# Altium project FuelCell.PrjPcb (part 2 of 3)

## Sheet TempController.SchDoc: TempController
size A3; ApprovedBy: ANBI; CheckedBy: ANBI; CompanyName: DongA FuelCell; DrawnBy: SEOKIPO; Engineer: SEOKIPO; Revision: 001; SheetNumber: 2; SheetTotal: 6
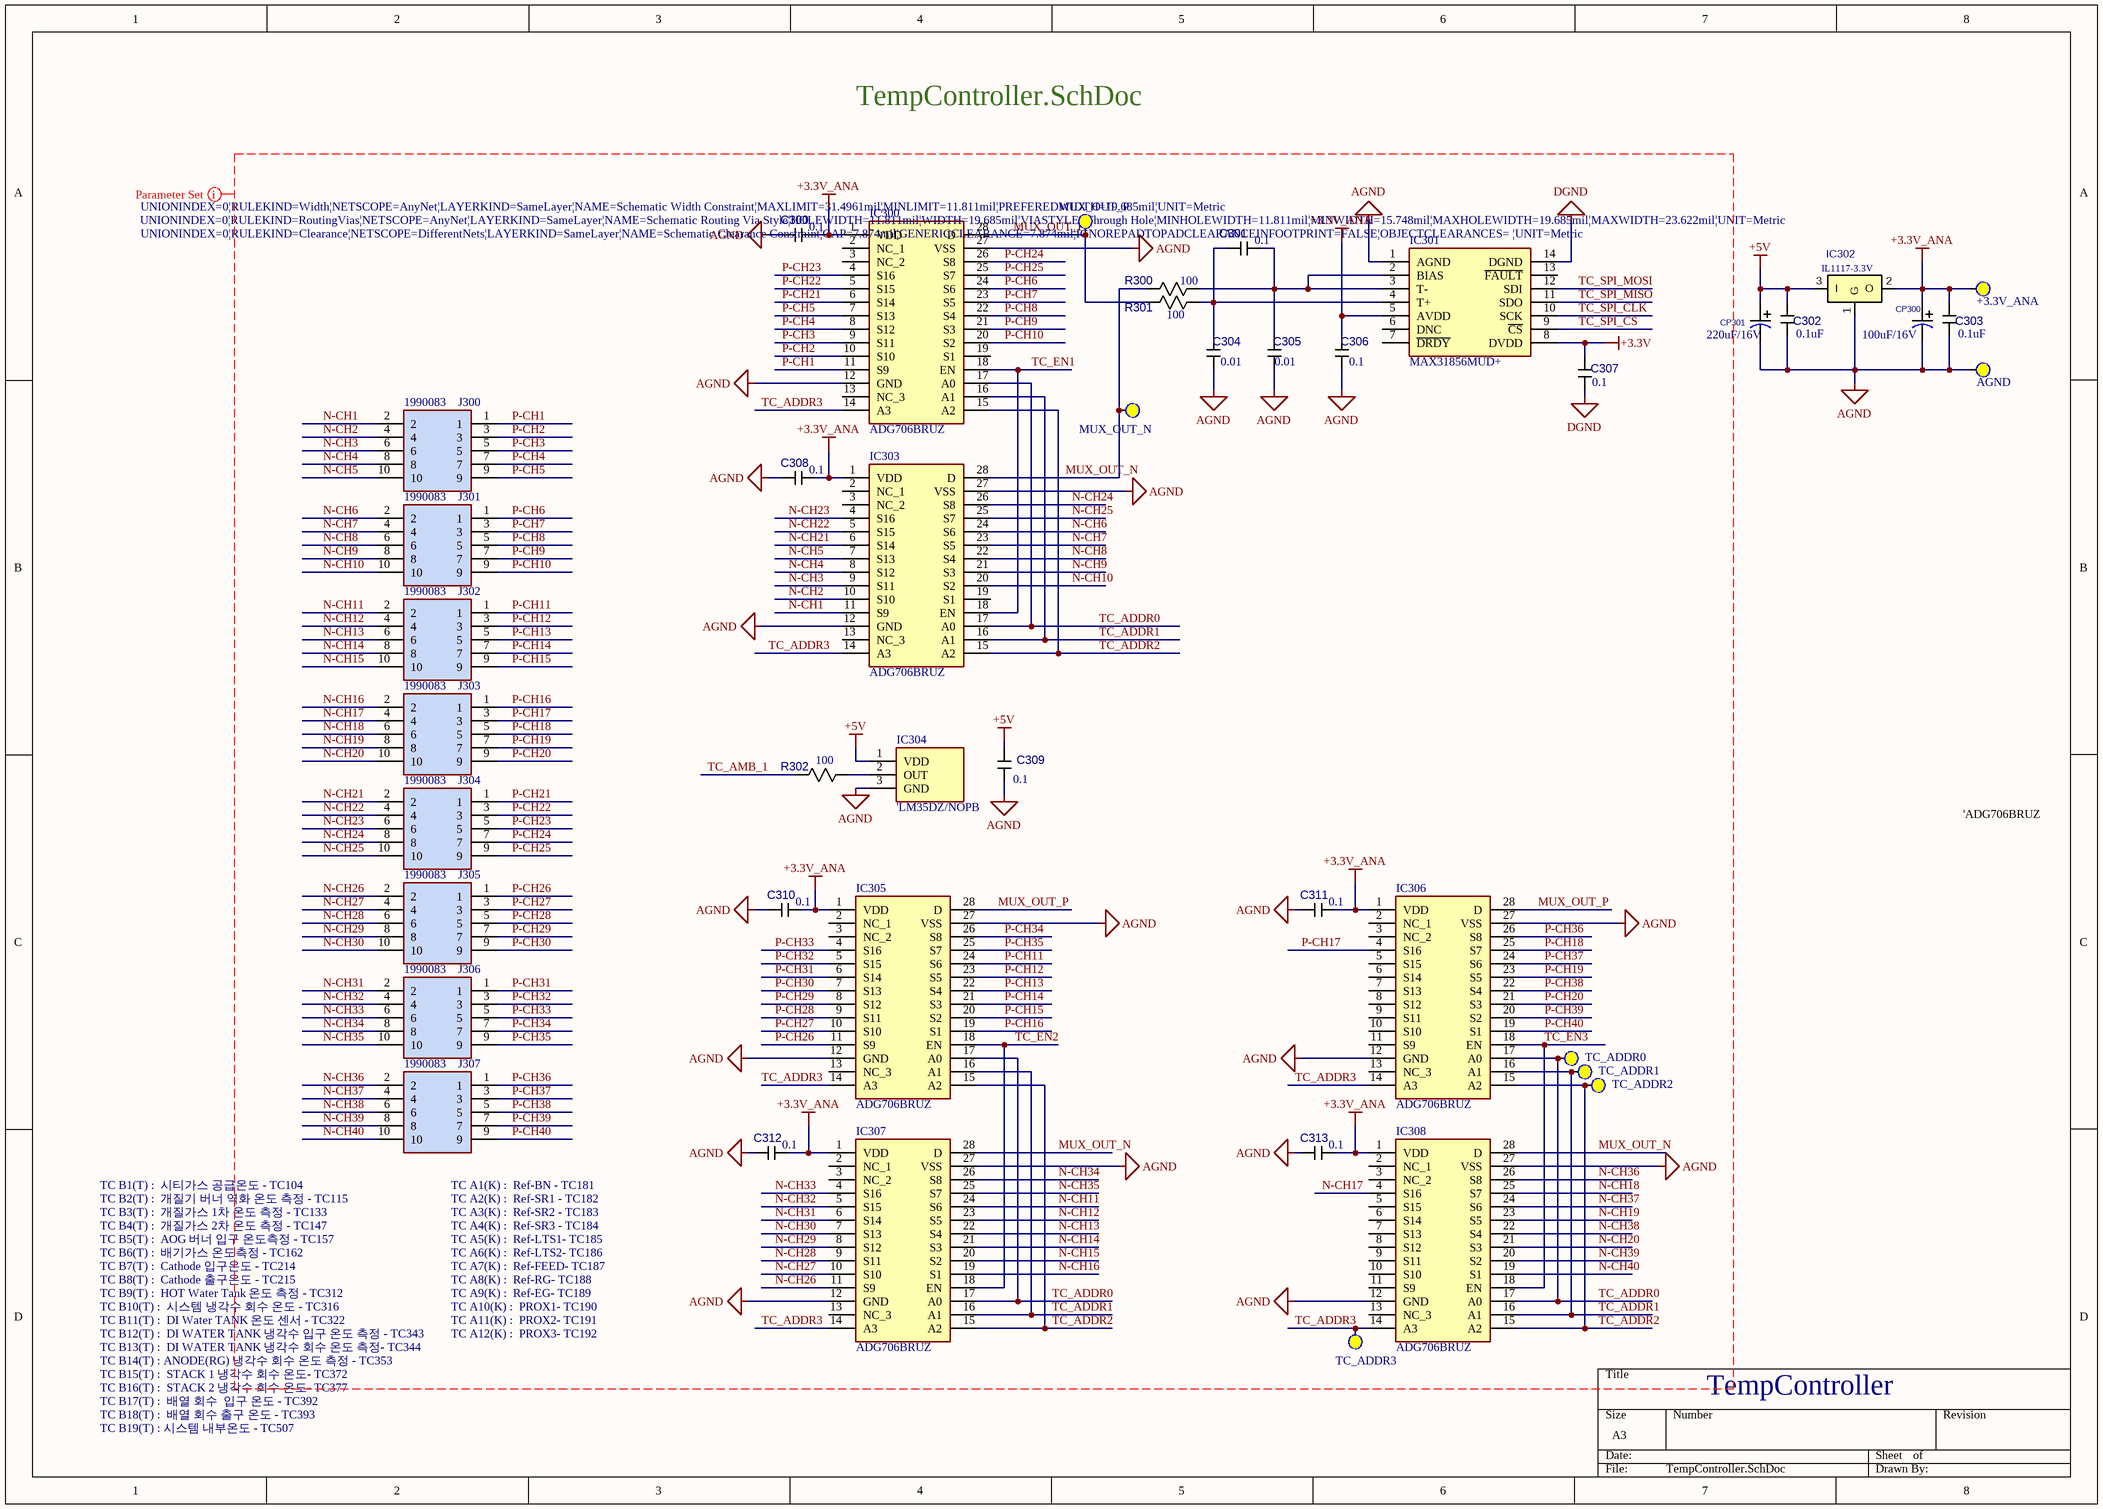
[diagram p6: TempController.SchDoc]

### Parts
(Parts that share a designator on the sheet are numbered #1, #2 ... from top to bottom, then left to right.)
+3.3V_ANA  Test Point_top  [TP_KEYSTONE_5000]  (value not drawn)
AGND#1  Test Point_top  [TP_KEYSTONE_5000]  (value not drawn)
C300  규격: 0.1  [CC1608N]  (hidden comment: CS1608)
C301  규격: 0.1  [CC1608N]  (hidden comment: CS1608)
C302  규격: 0.1uF  [CC1608N]  (hidden comment: CS1608)
C303  규격: 0.1uF  [CC1608N]  (hidden comment: CS1608)
C304  규격: 0.01  [CC1608N]  (hidden comment: CS1608)
C305  규격: 0.01  [CC1608N]  (hidden comment: CS1608)
C306  규격: 0.1  [CC1608N]  (hidden comment: CS1608)
C307  규격: 0.1  [CC1608N]  (hidden comment: CS1608)
C308  규격: 0.1  [CC1608N]  (hidden comment: CS1608)
C309  규격: 0.1  [CC1608N]  (hidden comment: CS1608)
C310  규격: 0.1  [CC1608N]  (hidden comment: CS1608)
C311  규격: 0.1  [CC1608N]  (hidden comment: CS1608)
C312  규격: 0.1  [CC1608N]  (hidden comment: CS1608)
C313  규격: 0.1  [CC1608N]  (hidden comment: CS1608)
CP300  규격: 100uF/16V  [CP5_SMT]  (hidden comment: CP5_SMT)
CP301  규격: 220uF/16V  [CP6_SMT]  (hidden comment: CP6_SMT)
IC300  ADG706BRUZ  [SOP65P640X120-28N]
IC301  MAX31856MUD+  [SOP65P640X110-14N]
IC302  Part No.: IL1117-3.3V  [SOT-223]  (hidden comment: 1117SO)
IC303  ADG706BRUZ  [SOP65P640X120-28N]
IC304  'LM35DZ/NOPB  [TO92]
IC305  ADG706BRUZ  [SOP65P640X120-28N]
IC306  ADG706BRUZ  [SOP65P640X120-28N]
IC307  ADG706BRUZ  [SOP65P640X120-28N]
IC308  ADG706BRUZ  [SOP65P640X120-28N]
J300  1990083  [1990083]
J301  1990083  [1990083]
J302  1990083  [1990083]
J303  1990083  [1990083]
J304  1990083  [1990083]
J305  1990083  [1990083]
J306  1990083  [1990083]
J307  1990083  [1990083]
MUX_OUT_N  Test Point_top  [TP_KEYSTONE_5000]  (value not drawn)
MUX_OUT_P  Test Point_top  [TP_KEYSTONE_5000]  (value not drawn)
R300  규격: 100  [RESC1608X55N]  (hidden comment: R1608)
R301  규격: 100  [RESC1608X55N]  (hidden comment: R1608)
R302  규격: 100  [RESC1608X55N]  (hidden comment: R1608)
TC_ADDR0  Test Point_top  [TP_KEYSTONE_5000]  (value not drawn)
TC_ADDR1  Test Point_top  [TP_KEYSTONE_5000]  (value not drawn)
TC_ADDR2  Test Point_top  [TP_KEYSTONE_5000]  (value not drawn)
TC_ADDR3  Test Point_top  [TP_KEYSTONE_5000]  (value not drawn)

### Nets
+3.3V: C307.2 IC301.8(DVDD)
+3.3V_ANA: +3.3V_ANA.1(tp) C300.1 C303.2 C306.2 C308.1 C310.1 C311.1 C312.1 C313.1 CP300.2 IC300.1(VDD) IC301.5(AVDD) IC302.2(O) IC303.1(VDD) IC305.1(VDD) IC306.1(VDD) IC307.1(VDD) IC308.1(VDD)
+5V: C302.2 C309.2 CP301.2 IC302.3(I) IC304.1(VDD)
AGND: AGND#1.1(tp) C300.2 C302.1 C303.1 C304.1 C305.2 C306.1 C308.2 C309.1 C310.2 C311.2 C312.2 C313.2 CP300.1 CP301.1 IC300.12(GND) IC300.27(VSS) IC301.1(AGND) IC302.1(G) IC303.12(GND) IC303.27(VSS) IC304.3(GND) IC305.12(GND) IC305.27(VSS) IC306.12(GND) IC306.27(VSS) IC307.12(GND) IC307.27(VSS) IC308.12(GND) IC308.27(VSS)
DGND: C307.1 IC301.14(DGND)
MUX_OUT_N: IC303.28(D) IC307.28(D) IC308.28(D) MUX_OUT_N.1(tp) R300.1
MUX_OUT_P: IC300.28(D) IC305.28(D) IC306.28(D) MUX_OUT_P.1(tp) R301.1
N-CH1: IC303.11(S9) J300.2
N-CH2: IC303.10(S10) J300.4
N-CH3: IC303.9(S11) J300.6
N-CH4: IC303.8(S12) J300.8
N-CH5: IC303.7(S13) J300.10
N-CH6: IC303.24(S6) J301.2
N-CH7: IC303.23(S5) J301.4
N-CH8: IC303.22(S4) J301.6
N-CH9: IC303.21(S3) J301.8
N-CH10: IC303.20(S2) J301.10
N-CH11: IC307.24(S6) J302.2
N-CH12: IC307.23(S5) J302.4
N-CH13: IC307.22(S4) J302.6
N-CH14: IC307.21(S3) J302.8
N-CH15: IC307.20(S2) J302.10
N-CH16: IC307.19(S1) J303.2
N-CH17: IC308.4(S16) J303.4
N-CH18: IC308.25(S7) J303.6
N-CH19: IC308.23(S5) J303.8
N-CH20: IC308.21(S3) J303.10
N-CH21: IC303.6(S14) J304.2
N-CH22: IC303.5(S15) J304.4
N-CH23: IC303.4(S16) J304.6
N-CH24: IC303.26(S8) J304.8
N-CH25: IC303.25(S7) J304.10
N-CH26: IC307.11(S9) J305.2
N-CH27: IC307.10(S10) J305.4
N-CH28: IC307.9(S11) J305.6
N-CH29: IC307.8(S12) J305.8
N-CH30: IC307.7(S13) J305.10
N-CH31: IC307.6(S14) J306.2
N-CH32: IC307.5(S15) J306.4
N-CH33: IC307.4(S16) J306.6
N-CH34: IC307.26(S8) J306.8
N-CH35: IC307.25(S7) J306.10
N-CH36: IC308.26(S8) J307.2
N-CH37: IC308.24(S6) J307.4
N-CH38: IC308.22(S4) J307.6
N-CH39: IC308.20(S2) J307.8
N-CH40: IC308.19(S1) J307.10
P-CH1: IC300.11(S9) J300.1
P-CH2: IC300.10(S10) J300.3
P-CH3: IC300.9(S11) J300.5
P-CH4: IC300.8(S12) J300.7
P-CH5: IC300.7(S13) J300.9
P-CH6: IC300.24(S6) J301.1
P-CH7: IC300.23(S5) J301.3
P-CH8: IC300.22(S4) J301.5
P-CH9: IC300.21(S3) J301.7
P-CH10: IC300.20(S2) J301.9
P-CH11: IC305.24(S6) J302.1
P-CH12: IC305.23(S5) J302.3
P-CH13: IC305.22(S4) J302.5
P-CH14: IC305.21(S3) J302.7
P-CH15: IC305.20(S2) J302.9
P-CH16: IC305.19(S1) J303.1
P-CH17: IC306.4(S16) J303.3
P-CH18: IC306.25(S7) J303.5
P-CH19: IC306.23(S5) J303.7
P-CH20: IC306.21(S3) J303.9
P-CH21: IC300.6(S14) J304.1
P-CH22: IC300.5(S15) J304.3
P-CH23: IC300.4(S16) J304.5
P-CH24: IC300.26(S8) J304.7
P-CH25: IC300.25(S7) J304.9
P-CH26: IC305.11(S9) J305.1
P-CH27: IC305.10(S10) J305.3
P-CH28: IC305.9(S11) J305.5
P-CH29: IC305.8(S12) J305.7
P-CH30: IC305.7(S13) J305.9
P-CH31: IC305.6(S14) J306.1
P-CH32: IC305.5(S15) J306.3
P-CH33: IC305.4(S16) J306.5
P-CH34: IC305.26(S8) J306.7
P-CH35: IC305.25(S7) J306.9
P-CH36: IC306.26(S8) J307.1
P-CH37: IC306.24(S6) J307.3
P-CH38: IC306.22(S4) J307.5
P-CH39: IC306.20(S2) J307.7
P-CH40: IC306.19(S1) J307.9
TC_ADDR0: IC300.17(A0) IC303.17(A0) IC305.17(A0) IC306.17(A0) IC307.17(A0) IC308.17(A0) TC_ADDR0.1(tp)
TC_ADDR1: IC300.16(A1) IC303.16(A1) IC305.16(A1) IC306.16(A1) IC307.16(A1) IC308.16(A1) TC_ADDR1.1(tp)
TC_ADDR2: IC300.15(A2) IC303.15(A2) IC305.15(A2) IC306.15(A2) IC307.15(A2) IC308.15(A2) TC_ADDR2.1(tp)
TC_ADDR3: IC300.14(A3) IC303.14(A3) IC305.14(A3) IC306.14(A3) IC307.14(A3) IC308.14(A3) TC_ADDR3.1(tp)
TC_AMB_1: R302.1
TC_EN1: IC300.18(EN) IC303.18(EN)
TC_EN2: IC305.18(EN) IC307.18(EN)
TC_EN3: IC306.18(EN) IC308.18(EN)
TC_SPI_CLK: IC301.10(SCK)
TC_SPI_CS: IC301.9(~{CS})
TC_SPI_MISO: IC301.11(SDO)
TC_SPI_MOSI: IC301.12(SDI)
NetC301_1: C301.1 C305.1 IC301.2(BIAS) IC301.3(T-) R300.2
NetC301_2: C301.2 C304.2 IC301.4(T+) R301.2
NetIC304_2: IC304.2(OUT) R302.2

Not connected (* = marked no-connect by the designer): IC300 2(NC_1) 3(NC_2) 13(NC_3) 19(S1); IC301 6(DNC) 7(~{DRDY}) 13(~{FAULT}); IC302 4; IC303 2(NC_1) 3(NC_2) 13(NC_3) 19(S1); IC305 2(NC_1) 3(NC_2) 13(NC_3); IC306 2(NC_1) 3(NC_2) 5(S15) 6(S14) 7(S13) 8(S12) 9(S11) 10(S10) 11(S9) 13(NC_3); IC307 2(NC_1) 3(NC_2) 13(NC_3); IC308 2(NC_1) 3(NC_2) 5(S15) 6(S14) 7(S13) 8(S12) 9(S11) 10(S10) 11(S9) 13(NC_3)

### Layout directives
rule Width Constraint [Pref Width = 0.5mm    Min Width = 0.3mm    Max Width = 0.8mm]; rule Routing Via Style [Pref Size = 0.5mm    Pref Hole Size = 0.3mm]; rule Clearance Constraint [Clearance = 0.2mm]: +3.3V, +3.3V_ANA, +5V, AGND, DGND, MUX_OUT_N, MUX_OUT_P, N-CH1, N-CH2, N-CH3, N-CH4, N-CH5, N-CH6, N-CH7, N-CH8, N-CH9, N-CH10, N-CH11, N-CH12, N-CH13, N-CH14, N-CH15, N-CH16, N-CH17, N-CH18, N-CH19, N-CH20, N-CH21, N-CH22, N-CH23, N-CH24, N-CH25, N-CH26, N-CH27, N-CH28, N-CH29, N-CH30, N-CH31, N-CH32, N-CH33, N-CH34, N-CH35, N-CH36, N-CH37, N-CH38, N-CH39, N-CH40, P-CH1, P-CH2, P-CH3, P-CH4, P-CH5, P-CH6, P-CH7, P-CH8, P-CH9, P-CH10, P-CH11, P-CH12, P-CH13, P-CH14, P-CH15, P-CH16, P-CH17, P-CH18, P-CH19, P-CH20, P-CH21, P-CH22, P-CH23, P-CH24, P-CH25, P-CH26, P-CH27, P-CH28, P-CH29, P-CH30, P-CH31, P-CH32, P-CH33, P-CH34, P-CH35, P-CH36, P-CH37, P-CH38, P-CH39, P-CH40, TC_ADDR0, TC_ADDR1, TC_ADDR2, TC_ADDR3, TC_AMB_1, TC_EN1, TC_EN2, TC_EN3, TC_SPI_CLK, TC_SPI_CS, TC_SPI_MISO, TC_SPI_MOSI

### Notes on the sheet
- TempController.SchDoc
- 'ADG706BRUZ
- TC B1(T) :  시티가스 공급온도 - TC104
- (near J307) TC A1(K) :  Ref-BN - TC181
- TC B2(T) :  개질기 버너 역화 온도 측정 - TC115
- TC B3(T) :  개질가스 1차 온도 측정 - TC133
- TC B5(T) :  AOG 버너 입구 온도측정 - TC157
- TC B4(T) :  개질가스 2차 온도 측정 - TC147
- TC B6(T) :  배기가스 온도측정 - TC162
- TC A2(K) :  Ref-SR1 - TC182
- TC A3(K) :  Ref-SR2 - TC183
- TC A4(K) :  Ref-SR3 - TC184
- TC A5(K) :  Ref-LTS1- TC185
- TC A6(K) :  Ref-LTS2- TC186
- TC B7(T) :  Cathode 입구온도 - TC214
- TC B8(T) :  Cathode 출구온도 - TC215
- TC B9(T) :  HOT Water Tank 온도 측정 - TC312
- TC B10(T) :  시스템 냉각수 회수 온도 - TC316
- TC B11(T) :  DI Water TANK 온도 센서 - TC322
- TC A8(K) :  Ref-RG- TC188
- TC A9(K) :  Ref-EG- TC189
- TC A10(K) :  PROX1- TC190
- TC A7(K) :  Ref-FEED- TC187
- TC A11(K) :  PROX2- TC191
- TC B12(T) :  DI WATER TANK 냉각수 입구 온도 측정 - TC343
- TC B13(T) :  DI WATER TANK 냉각수 회수 온도 측정- TC344
- TC B14(T) : ANODE(RG) 냉각수 회수 온도 측정 - TC353
- TC B15(T) :  STACK 1 냉각수 회수 온도- TC372
- TC B16(T) :  STACK 2 냉각수 회수 온도- TC377
- TC A12(K) :  PROX3- TC192
- TC B17(T) :  배열 회수  입구 온도 - TC392
- TC B18(T) :  배열 회수 출구 온도 - TC393
- TC B19(T) : 시스템 내부온도 - TC507

### Library data of the parts
+3.3V_ANA AGND#1 MUX_OUT_N MUX_OUT_P TC_ADDR0 TC_ADDR1 TC_ADDR3 = Tp_5000: Pad30; Part No.: *
C300-C313 = CS1608: Part No.: {Part No}; Price: 6
CP300 = CP5_SMT: Part No.: {Part No}; Price: 31
CP301 = CP6_SMT: Part No.: RV16V220 6.3X7.7 (ELNA / 삼영); ComponentLink1Description: New link; ComponentLink1URL: *; Price: 40
IC300 IC303 IC305 IC307 IC308 = ADG706BRU-REEL7: Integrated Circuit; Manufacturer_Name: Analog Devices; Height: 1.2mm; Manufacturer_Part_Number: ADG706BRU-REEL7; Price: 7220; Part No.: ADG706BRUZ
IC301 = MAX31856MUD+: Integrated Circuit; Height: 1.1mm; Part No.: MAX31856MUD+; Price: 4490
IC302 = 1117SO: Value: 3.3V/1A; Price: 150
IC304 = LM35: Integrated Circuit; Height: 4.95mm; Price: 610; Part No.: LM35DZ/NOPB
IC306 = ADG706BRU-REEL7: Integrated Circuit; Price: 7220; Part No.: ADG706BRUZ
J300-J307 = 1990083: PTSA 0,5/10-2,5-Z - Printed circuit board terminal, nominal current: 2 A, rated voltage (III/2): 250 V, nominal cross section: 0.5 mm<sup>2</sup>, number of potentials: 10, number of rows: 1, number of positions per row: 10, product range: PTSA 0,5, pitch: 2.5 mm, connection method: Push-in spring connection, mounting: Wave soldering, conductor/PCB connection direction: 45 , color: green, Pin layout: Zigzag pinning W, Solder pin [P]: 3.6 mm, number of solder pins per potential: 1, type of packaging: packed; Manufacturer_Name: Phoenix Contact; Geometry.Height: 13.1mm; Part No.: 1990083; Price: 2320
  J300: Mouser Price/Stock: https://www.mouser.co.uk/ProductDetail/Phoenix-Contact/1990083?qs=eiqBpq341KUxP7V1ZFOCBQ%3D%3D
  J301-J307: Arrow Price/Stock: https://www.arrow.com/en/products/1990083/phoenix-contact.html?utm_currency=USD&region=nac
R300-R302 = R1608: Part No.: WR06X101JT(100R)J; Price: 1.0
TC_ADDR2 = Tp_5000: Pad30; NetName: .NetName; Part No.: *

## Sheet Input_Section.SchDoc: Input_Section
size A2; Date: 2026-04-25; ApprovedBy: Anbi; CheckedBy: Anbi; Author: FunnyElecs; CompanyName: DongA; DrawnBy: Seokipo; Engineer: Seokipo; Revision: 1.0; SheetNumber: 3; SheetTotal: 6
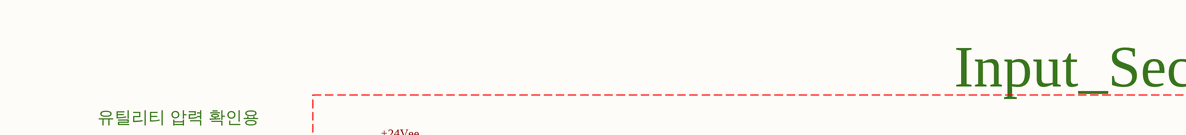
[diagram p7: Input_Section.SchDoc, top left]
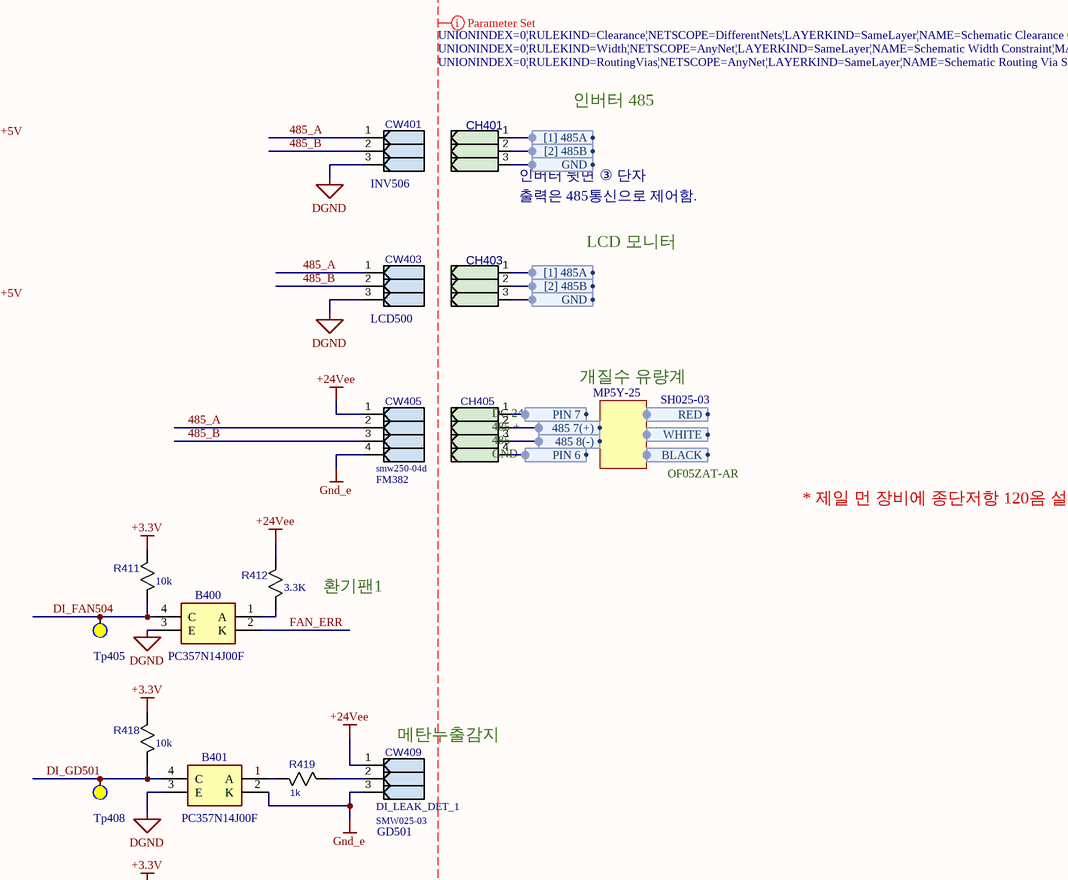
[diagram p8: Input_Section.SchDoc, top right]
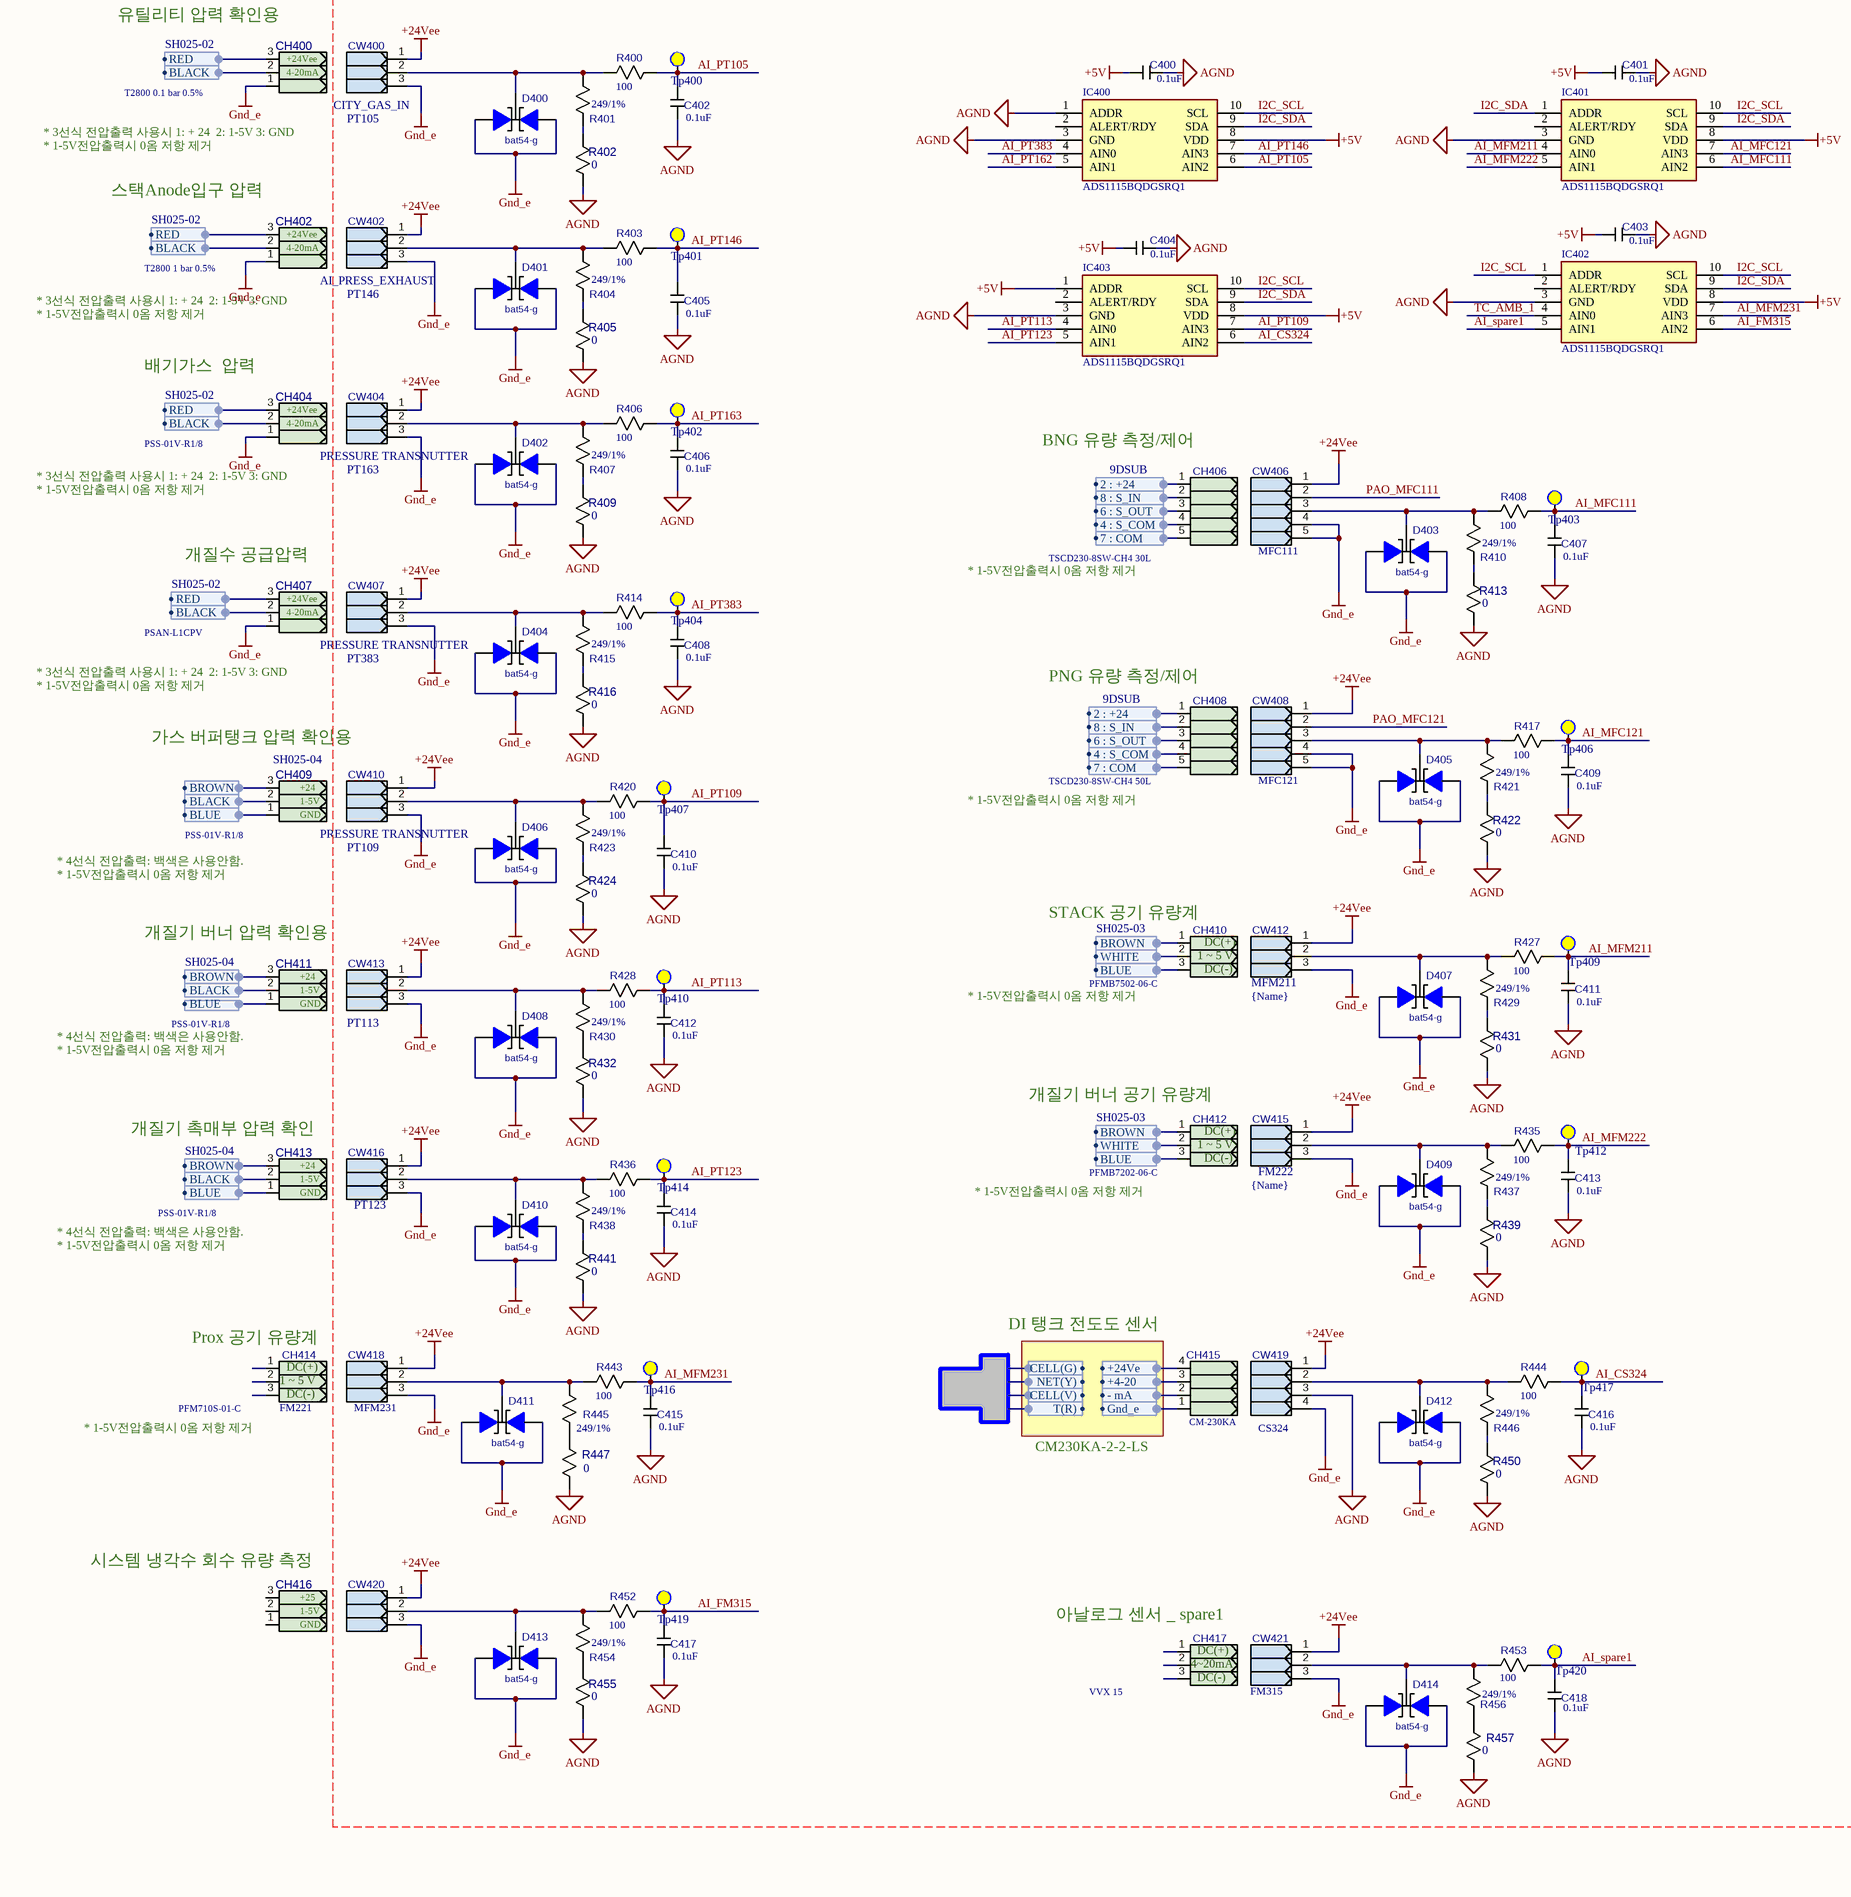
[diagram p9: Input_Section.SchDoc, bottom left]
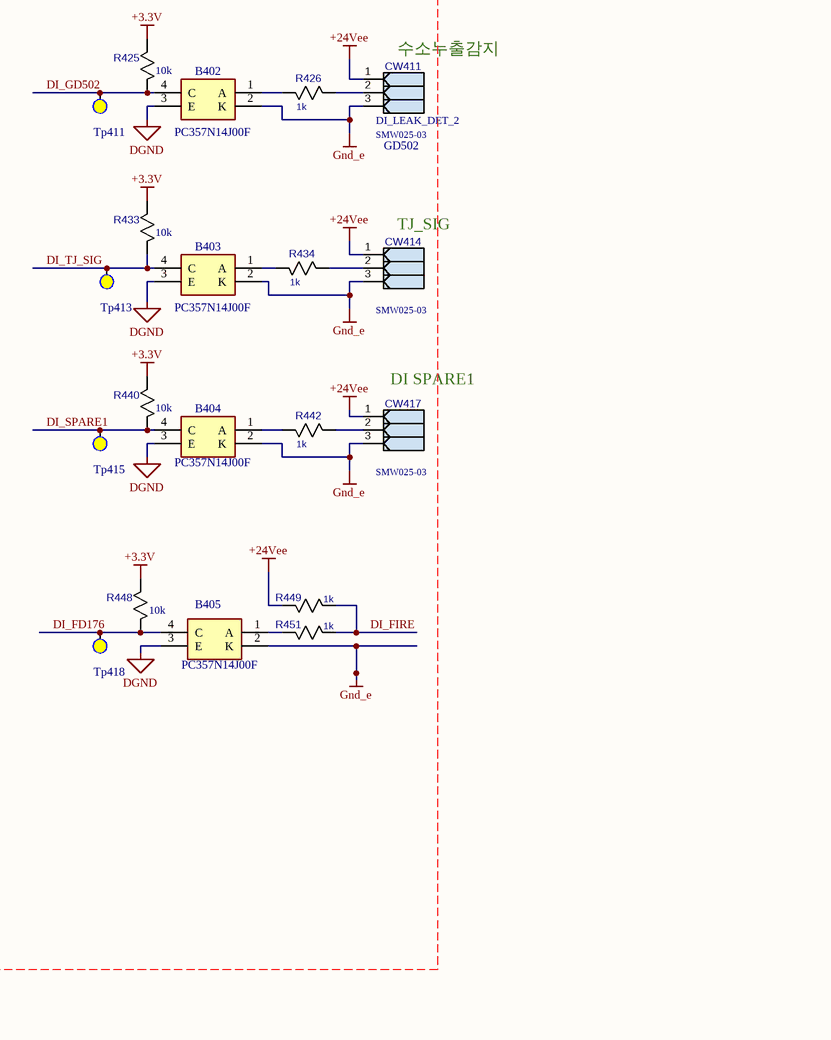
[diagram p10: Input_Section.SchDoc, bottom right]

### Parts
B400  PC357N14J00F  [SOP254P675X300-4N]
B401  PC357N14J00F  [SOP254P675X300-4N]
B402  PC357N14J00F  [SOP254P675X300-4N]
B403  PC357N14J00F  [SOP254P675X300-4N]
B404  PC357N14J00F  [SOP254P675X300-4N]
B405  PC357N14J00F  [SOP254P675X300-4N]
C400  규격: 0.1uF  [CC1608N]  (hidden comment: CS1608)
C401  규격: 0.1uF  [CC1608N]  (hidden comment: CS1608)
C402  규격: 0.1uF  [CC1608N]  (hidden comment: CS1608)
C403  규격: 0.1uF  [CC1608N]  (hidden comment: CS1608)
C404  규격: 0.1uF  [CC1608N]  (hidden comment: CS1608)
C405  규격: 0.1uF  [CC1608N]  (hidden comment: CS1608)
C406  규격: 0.1uF  [CC1608N]  (hidden comment: CS1608)
C407  규격: 0.1uF  [CC1608N]  (hidden comment: CS1608)
C408  규격: 0.1uF  [CC1608N]  (hidden comment: CS1608)
C409  규격: 0.1uF  [CC1608N]  (hidden comment: CS1608)
C410  규격: 0.1uF  [CC1608N]  (hidden comment: CS1608)
C411  규격: 0.1uF  [CC1608N]  (hidden comment: CS1608)
C412  규격: 0.1uF  [CC1608N]  (hidden comment: CS1608)
C413  규격: 0.1uF  [CC1608N]  (hidden comment: CS1608)
C414  규격: 0.1uF  [CC1608N]  (hidden comment: CS1608)
C415  규격: 0.1uF  [CC1608N]  (hidden comment: CS1608)
C416  규격: 0.1uF  [CC1608N]  (hidden comment: CS1608)
C417  규격: 0.1uF  [CC1608N]  (hidden comment: CS1608)
C418  규격: 0.1uF  [CC1608N]  (hidden comment: CS1608)
CH400  Part No.: T2800 0.1 bar 0.5%  (hidden comment: Connect Housing)
CH401  Connect Housing  (value not drawn)
CH402  Part No.: T2800 1 bar 0.5%  (hidden comment: Connect Housing)
CH403  Connect Housing  (value not drawn)
CH404  Part No.: PSS-01V-R1/8  (hidden comment: Connect Housing)
CH405  Connect Housing  (value not drawn)
CH406  Part No.: TSCD230-8SW-CH4 30L  (hidden comment: Connect Housing)
CH407  Part No.: PSAN-L1CPV  (hidden comment: Connect Housing)
CH408  Part No.: TSCD230-8SW-CH4 50L  (hidden comment: Connect Housing)
CH409  Part No.: PSS-01V-R1/8  (hidden comment: Connect Housing)
CH410  Part No.: PFMB7502-06-C  (hidden comment: Connect Housing)
CH411  Part No.: PSS-01V-R1/8  (hidden comment: Connect Housing)
CH412  Part No.: PFMB7202-06-C  (hidden comment: Connect Housing)
CH413  Part No.: PSS-01V-R1/8  (hidden comment: Connect Housing)
CH414  Part No.: PFM710S-01-C  BOP No: FM221  (hidden comment: Connect Housing)
CH415  Part No.: CM-230KA  (hidden comment: Connect Housing)
CH416  Connect Housing  (value not drawn)
CH417  Part No.: VVX 15  (hidden comment: Connect Housing)
CW400  Name: CITY_GAS_IN  BOP No: PT105  [SMW250-03D]  (hidden comment: SMW250-03D)
CW401  BOP No: INV506  [SMW250-03D]  (hidden comment: SMW250-03D)
CW402  Name: AI_PRESS_EXHAUST  BOP No: PT146  [SMW250-03D]  (hidden comment: SMW250-03D)
CW403  BOP No: LCD500  [SMW250-03D]  (hidden comment: SMW250-03D)
CW404  Name: PRESSURE TRANSNUTTER  BOP No: PT163  [SMW250-03D]  (hidden comment: SMW250-03D)
CW405  BOP No: FM382  [SMW250-04D]  (hidden comment: SMW250-04D)
CW406  BOP No: MFC111  [SMW250-05D]  (hidden comment: SMW250-05D)
CW407  Name: PRESSURE TRANSNUTTER  BOP No: PT383  [SMW250-03D]  (hidden comment: SMW250-03D)
CW408  BOP No: MFC121  [SMW250-05D]  (hidden comment: SMW250-05D)
CW409  Name: DI_LEAK_DET_1  Part No.: SMW025-03  BOP No: GD501  [SMW250-03D]  (hidden comment: SMW250-03D)
CW410  Name: PRESSURE TRANSNUTTER  BOP No: PT109  [SMW250-03D]  (hidden comment: SMW250-03D)
CW411  Name: DI_LEAK_DET_2  Part No.: SMW025-03  BOP No: GD502  [SMW250-03D]  (hidden comment: SMW250-03D)
CW412  Name: {Name}  BOP No: MFM211  [SMW250-03D]  (hidden comment: SMW250-03D)
CW413  BOP No: PT113  [SMW250-03D]  (hidden comment: SMW250-03D)
CW414  Part No.: SMW025-03  [SMW250-03D]  (hidden comment: SMW250-03D)
CW415  Name: {Name}  BOP No: FM222  [SMW250-03D]  (hidden comment: SMW250-03D)
CW416  BOP No: PT123  [SMW250-03D]  (hidden comment: SMW250-03D)
CW417  Part No.: SMW025-03  [SMW250-03D]  (hidden comment: SMW250-03D)
CW418  BOP No: MFM231  [SMW250-03D]  (hidden comment: SMW250-03D)
CW419  BOP No: CS324  [SMW250-04D]  (hidden comment: SMW250-04D)
CW420  SMW250-03D  [SMW250-03D]  (value not drawn)
CW421  BOP No: FM315  [SMW250-03D]  (hidden comment: SMW250-03D)
D400  Part No.: bat54-g  [SOT-23]  (hidden comment: BAT54C-G)
D401  Part No.: bat54-g  [SOT-23]  (hidden comment: BAT54C-G)
D402  Part No.: bat54-g  [SOT-23]  (hidden comment: BAT54C-G)
D403  Part No.: bat54-g  [SOT-23]  (hidden comment: BAT54C-G)
D404  Part No.: bat54-g  [SOT-23]  (hidden comment: BAT54C-G)
D405  Part No.: bat54-g  [SOT-23]  (hidden comment: BAT54C-G)
D406  Part No.: bat54-g  [SOT-23]  (hidden comment: BAT54C-G)
D407  Part No.: bat54-g  [SOT-23]  (hidden comment: BAT54C-G)
D408  Part No.: bat54-g  [SOT-23]  (hidden comment: BAT54C-G)
D409  Part No.: bat54-g  [SOT-23]  (hidden comment: BAT54C-G)
D410  Part No.: bat54-g  [SOT-23]  (hidden comment: BAT54C-G)
D411  Part No.: bat54-g  [SOT-23]  (hidden comment: BAT54C-G)
D412  Part No.: bat54-g  [SOT-23]  (hidden comment: BAT54C-G)
D413  Part No.: bat54-g  [SOT-23]  (hidden comment: BAT54C-G)
D414  Part No.: bat54-g  [SOT-23]  (hidden comment: BAT54C-G)
IC400  ADS1115BQDGSRQ1  [SOP50P490X110-10N]
IC401  ADS1115BQDGSRQ1  [SOP50P490X110-10N]
IC402  ADS1115BQDGSRQ1  [SOP50P490X110-10N]
IC403  ADS1115BQDGSRQ1  [SOP50P490X110-10N]
R400  규격: 100  [RESC1608X55N]  (hidden comment: R1608)
R401  규격: 249/1%  [RESC1608X55N]  (hidden comment: R1608)
R402  규격: 0  [R3216]  (hidden comment: R3216)
R403  규격: 100  [RESC1608X55N]  (hidden comment: R1608)
R404  규격: 249/1%  [RESC1608X55N]  (hidden comment: R1608)
R405  규격: 0  [R3216]  (hidden comment: R3216)
R406  규격: 100  [RESC1608X55N]  (hidden comment: R1608)
R407  규격: 249/1%  [RESC1608X55N]  (hidden comment: R1608)
R408  규격: 100  [RESC1608X55N]  (hidden comment: R1608)
R409  규격: 0  [R3216]  (hidden comment: R3216)
R410  규격: 249/1%  [RESC1608X55N]  (hidden comment: R1608)
R411  규격: 10k  [RESC1608X55N]  (hidden comment: R1608)
R412  규격: 3.3K  [RESC1608X55N]  (hidden comment: R1608)
R413  규격: 0  [R3216]  (hidden comment: R3216)
R414  규격: 100  [RESC1608X55N]  (hidden comment: R1608)
R415  규격: 249/1%  [RESC1608X55N]  (hidden comment: R1608)
R416  규격: 0  [R3216]  (hidden comment: R3216)
R417  규격: 100  [RESC1608X55N]  (hidden comment: R1608)
R418  규격: 10k  [RESC1608X55N]  (hidden comment: R1608)
R419  Part No.: 1k  [R2012]  (hidden comment: R2012)
R420  규격: 100  [RESC1608X55N]  (hidden comment: R1608)
R421  규격: 249/1%  [RESC1608X55N]  (hidden comment: R1608)
R422  규격: 0  [R3216]  (hidden comment: R3216)
R423  규격: 249/1%  [RESC1608X55N]  (hidden comment: R1608)
R424  규격: 0  [R3216]  (hidden comment: R3216)
R425  규격: 10k  [RESC1608X55N]  (hidden comment: R1608)
R426  Part No.: 1k  [R2012]  (hidden comment: R2012)
R427  규격: 100  [RESC1608X55N]  (hidden comment: R1608)
R428  규격: 100  [RESC1608X55N]  (hidden comment: R1608)
R429  규격: 249/1%  [RESC1608X55N]  (hidden comment: R1608)
R430  규격: 249/1%  [RESC1608X55N]  (hidden comment: R1608)
R431  규격: 0  [R3216]  (hidden comment: R3216)
R432  규격: 0  [R3216]  (hidden comment: R3216)
R433  규격: 10k  [RESC1608X55N]  (hidden comment: R1608)
R434  Part No.: 1k  [R2012]  (hidden comment: R2012)
R435  규격: 100  [RESC1608X55N]  (hidden comment: R1608)
R436  규격: 100  [RESC1608X55N]  (hidden comment: R1608)
R437  규격: 249/1%  [RESC1608X55N]  (hidden comment: R1608)
R438  규격: 249/1%  [RESC1608X55N]  (hidden comment: R1608)
R439  규격: 0  [R3216]  (hidden comment: R3216)
R440  규격: 10k  [RESC1608X55N]  (hidden comment: R1608)
R441  규격: 0  [R3216]  (hidden comment: R3216)
R442  Part No.: 1k  [R2012]  (hidden comment: R2012)
R443  규격: 100  [RESC1608X55N]  (hidden comment: R1608)
R444  규격: 100  [RESC1608X55N]  (hidden comment: R1608)
R445  규격: 249/1%  [RESC1608X55N]  (hidden comment: R1608)
R446  규격: 249/1%  [RESC1608X55N]  (hidden comment: R1608)
R447  규격: 0  [R3216]  (hidden comment: R3216)
R448  규격: 10k  [RESC1608X55N]  (hidden comment: R1608)
R449  Part No.: 1k  [R2012]  (hidden comment: R2012)
R450  규격: 0  [R3216]  (hidden comment: R3216)
R451  Part No.: 1k  [R2012]  (hidden comment: R2012)
R452  규격: 100  [RESC1608X55N]  (hidden comment: R1608)
R453  규격: 100  [RESC1608X55N]  (hidden comment: R1608)
R454  규격: 249/1%  [RESC1608X55N]  (hidden comment: R1608)
R455  규격: 0  [R3216]  (hidden comment: R3216)
R456  규격: 249/1%  [RESC1608X55N]  (hidden comment: R1608)
R457  규격: 0  [R3216]  (hidden comment: R3216)
Tp400  Test Point_top  [TP_KEYSTONE_5000]  (value not drawn)
Tp401  Test Point_top  [TP_KEYSTONE_5000]  (value not drawn)
Tp402  Test Point_top  [TP_KEYSTONE_5000]  (value not drawn)
Tp403  Test Point_top  [TP_KEYSTONE_5000]  (value not drawn)
Tp404  Test Point_top  [TP_KEYSTONE_5000]  (value not drawn)
Tp405  Test Point_top  [TP_KEYSTONE_5000]  (value not drawn)
Tp406  Test Point_top  [TP_KEYSTONE_5000]  (value not drawn)
Tp407  Test Point_top  [TP_KEYSTONE_5000]  (value not drawn)
Tp408  Test Point_top  [TP_KEYSTONE_5000]  (value not drawn)
Tp409  Test Point_top  [TP_KEYSTONE_5000]  (value not drawn)
Tp410  Test Point_top  [TP_KEYSTONE_5000]  (value not drawn)
Tp411  Test Point_top  [TP_KEYSTONE_5000]  (value not drawn)
Tp412  Test Point_top  [TP_KEYSTONE_5000]  (value not drawn)
Tp413  Test Point_top  [TP_KEYSTONE_5000]  (value not drawn)
Tp414  Test Point_top  [TP_KEYSTONE_5000]  (value not drawn)
Tp415  Test Point_top  [TP_KEYSTONE_5000]  (value not drawn)
Tp416  Test Point_top  [TP_KEYSTONE_5000]  (value not drawn)
Tp417  Test Point_top  [TP_KEYSTONE_5000]  (value not drawn)
Tp418  Test Point_top  [TP_KEYSTONE_5000]  (value not drawn)
Tp419  Test Point_top  [TP_KEYSTONE_5000]  (value not drawn)
Tp420  Test Point_top  [TP_KEYSTONE_5000]  (value not drawn)

### Harnesses
9DSUB: 2 : +24
*: 4 : S_COM
*: 6 : S_OUT
*: 8 : S_IN
*: 7 : COM
SH025-02: RED
?: BLACK
SH025-04: BROWN
?: BLUE
SH025-03: BROWN
?: WHITE
SH025-02: +4-20
?: - mA
SH025-03: RED
MP5Y-25: PIN 7
?: 485 7(+)
?: 485 8(-)
?: PIN 6
?: [1] 485A
?: [2] 485B
SH025-02: +24Ve
SH025-02: Gnd_e
SH025-02: NET(Y)
?: CELL(V)
SH025-02: CELL(G)
SH025-02: T(R)
?: GND

### Nets
+3.3V: R411.2 R418.2 R425.2 R433.2 R440.2 R448.2
+5V: C400.1 C401.1 C403.1 C404.1 IC400.8(VDD) IC401.8(VDD) IC402.8(VDD) IC403.1(ADDR) IC403.8(VDD)
+24Vee: CW400.1 CW402.1 CW404.1 CW405.1 CW406.1 CW407.1 CW408.1 CW409.1 CW410.1 CW411.1 CW412.1 CW413.1 CW414.1 CW415.1 CW416.1 CW417.1 CW418.1 CW419.1 CW420.1 CW421.1 R412.2 R449.2
AGND: C400.2 C401.2 C402.2 C403.2 C404.2 C405.2 C406.2 C407.2 C408.2 C409.2 C410.2 C411.2 C412.2 C413.2 C414.2 C415.2 C416.2 C417.2 C418.2 CW419.3 IC400.1(ADDR) IC400.3(GND) IC401.3(GND) IC402.3(GND) IC403.3(GND) R402.1 R405.1 R409.1 R413.1 R416.1 R422.1 R424.1 R431.1 R432.1 R439.1 R441.1 R447.1 R450.1 R455.1 R457.1
DGND: B400.3(E) B401.3(E) B402.3(E) B403.3(E) B404.3(E) B405.3(E) CW401.3 CW403.3
Gnd_e: B401.2(K) B402.2(K) B403.2(K) B404.2(K) B405.2(K) CH400.1 CH402.1 CH404.1 CH407.1 CW400.3 CW402.3 CW404.3 CW405.4 CW406.4 CW406.5 CW407.3 CW408.4 CW408.5 CW409.3 CW410.3 CW411.3 CW412.3 CW413.3 CW414.3 CW415.3 CW416.3 CW417.3 CW418.3 CW419.4 CW420.3 CW421.3 D400.1 D400.2 D401.1 D401.2 D402.1 D402.2 D403.1 D403.2 D404.1 D404.2 D405.1 D405.2 D406.1 D406.2 D407.1 D407.2 D408.1 D408.2 D409.1 D409.2 D410.1 D410.2 D411.1 D411.2 D412.1 D412.2 D413.1 D413.2 D414.1 D414.2
485_A: CW401.1 CW403.1 CW405.2
485_B: CW401.2 CW403.2 CW405.3
AI_CS324: C416.1 IC403.6(AIN2) R444.2 Tp417.1(tp)
AI_FM315: C417.1 IC402.6(AIN2) R452.2 Tp419.1(tp)
AI_MFC111: C407.1 IC401.6(AIN2) R408.2 Tp403.1(tp)
AI_MFC121: C409.1 IC401.7(AIN3) R417.2 Tp406.1(tp)
AI_MFM211: C411.1 IC401.4(AIN0) R427.2 Tp409.1(tp)
AI_MFM222: C413.1 IC401.5(AIN1) R435.2 Tp412.1(tp)
AI_MFM231: C415.1 IC402.7(AIN3) R443.2 Tp416.1(tp)
AI_PT105: C402.1 IC400.6(AIN2) R400.2 Tp400.1(tp)
AI_PT109: C410.1 IC403.7(AIN3) R420.2 Tp407.1(tp)
AI_PT113: C412.1 IC403.4(AIN0) R428.2 Tp410.1(tp)
AI_PT123: C414.1 IC403.5(AIN1) R436.2 Tp414.1(tp)
AI_PT146: C405.1 IC400.7(AIN3) R403.2 Tp401.1(tp)
AI_PT162: IC400.5(AIN1)
AI_PT163: C406.1 R406.2 Tp402.1(tp)
AI_PT383: C408.1 IC400.4(AIN0) R414.2 Tp404.1(tp)
AI_spare1: C418.1 IC402.5(AIN1) R453.2 Tp420.1(tp)
DI_FAN504: B400.4(C) R411.1 Tp405.1(tp)
DI_FD176: B405.4(C) R448.1 Tp418.1(tp)
DI_FIRE: R449.1 R451.1
DI_GD501: B401.4(C) R418.1 Tp408.1(tp)
DI_GD502: B402.4(C) R425.1 Tp411.1(tp)
DI_SPARE1: B404.4(C) R440.1 Tp415.1(tp)
DI_TJ_SIG: B403.4(C) R433.1 Tp413.1(tp)
FAN_ERR: B400.2(K)
I2C_SCL: IC400.10(SCL) IC401.10(SCL) IC402.1(ADDR) IC402.10(SCL) IC403.10(SCL)
I2C_SDA: IC400.9(SDA) IC401.1(ADDR) IC401.9(SDA) IC402.9(SDA) IC403.9(SDA)
PAO_MFC111: CW406.2
PAO_MFC121: CW408.2
TC_AMB_1: IC402.4(AIN0)
NetB400_1: B400.1(A) R412.1
NetB401_1: B401.1(A) R419.2
NetB402_1: B402.1(A) R426.2
NetB403_1: B403.1(A) R434.2
NetB404_1: B404.1(A) R442.2
NetB405_1: B405.1(A) R451.2
NetCW400_2: CW400.2 D400.3 R400.1 R401.2
NetCW402_2: CW402.2 D401.3 R403.1 R404.2
NetCW404_2: CW404.2 D402.3 R406.1 R407.2
NetCW406_3: CW406.3 D403.3 R408.1 R410.2
NetCW407_2: CW407.2 D404.3 R414.1 R415.2
NetCW408_3: CW408.3 D405.3 R417.1 R421.2
NetCW409_2: CW409.2 R419.1
NetCW410_2: CW410.2 D406.3 R420.1 R423.2
NetCW411_2: CW411.2 R426.1
NetCW412_2: CW412.2 D407.3 R427.1 R429.2
NetCW413_2: CW413.2 D408.3 R428.1 R430.2
NetCW414_2: CW414.2 R434.1
NetCW415_2: CW415.2 D409.3 R435.1 R437.2
NetCW416_2: CW416.2 D410.3 R436.1 R438.2
NetCW417_2: CW417.2 R442.1
NetCW418_2: CW418.2 D411.3 R443.1 R445.2
NetCW419_2: CW419.2 D412.3 R444.1 R446.2
NetCW420_2: CW420.2 D413.3 R452.1 R454.2
NetCW421_2: CW421.2 D414.3 R453.1 R456.2
NetR401_1: R401.1 R402.2
NetR404_1: R404.1 R405.2
NetR407_1: R407.1 R409.2
NetR410_1: R410.1 R413.2
NetR415_1: R415.1 R416.2
NetR421_1: R421.1 R422.2
NetR423_1: R423.1 R424.2
NetR429_1: R429.1 R431.2
NetR430_1: R430.1 R432.2
NetR437_1: R437.1 R439.2
NetR438_1: R438.1 R441.2
NetR445_1: R445.1 R447.2
NetR446_1: R446.1 R450.2
NetR454_1: R454.1 R455.2
NetR456_1: R456.1 R457.2

Not connected (* = marked no-connect by the designer): CH400 2 3; CH401 1 2 3; CH402 2 3; CH403 1 2 3; CH404 2 3; CH405 1 2 3 4; CH406 1 2 3 4 5; CH407 2 3; CH408 1 2 3 4 5; CH409 1 2 3; CH410 1 2 3; CH411 1 2 3; CH412 1 2 3; CH413 1 2 3; CH414 1 2 3; CH415 1 2 3 4; CH416 1 2 3; CH417 1 2 3; IC400 2(ALERT/RDY); IC401 2(ALERT/RDY); IC402 2(ALERT/RDY); IC403 2(ALERT/RDY)

### Layout directives
rule Clearance Constraint [Clearance = 0.2mm]; rule Width Constraint [Pref Width = 0.5mm    Min Width = 0.2mm    Max Width = 1mm]; rule Routing Via Style [Pref Size = 0.5mm    Pref Hole Size = 0.3mm]: 485_A, 485_B, +3.3V, +5V, +24Vee, AGND, AI_CS324, AI_FM315, AI_MFC111, AI_MFC121, AI_MFM211, AI_MFM222, AI_MFM231, AI_PT105, AI_PT109, AI_PT113, AI_PT123, AI_PT146, AI_PT162, AI_PT163, AI_PT383, AI_spare1, DGND, DI_FAN504, DI_FD176, DI_FIRE, DI_GD501, DI_GD502, DI_SPARE1, DI_TJ_SIG, FAN_ERR, Gnd_e, I2C_SCL, I2C_SDA, PAO_MFC111, PAO_MFC121, TC_AMB_1

### Notes on the sheet
- 유틸리티 압력 확인용
- Input_Section.SchDoc
- (near CH400) +24Vee
- (near CH400) 4-20mA
- (near CH400) 4-20
- (near CH400) -
- (near CH400) * 3선식 전압출력 사용시 1: + 24  2: 1-5V 3: GND
- * 1-5V전압출력시 0옴 저항 제거
- (near CH401) 인버터 485
- 스택Anode입구 압력
- (near CH402) +24Vee
- (near CH401) 인버터 뒷면 ③ 단자
- (near CH401) 출력은 485통신으로 제어함.
- (near CH402) 4-20mA
- (near CH403) LCD 모니터
- (near CH402) * 3선식 전압출력 사용시 1: + 24  2: 1-5V 3: GND
- 배기가스  압력
- (near CH404) 4-20mA
- (near CH404) +24Vee
- (near CH405) DC 24
- (near CH405) 개질수 유량계
- DC 12  5
- (near CH404) * 3선식 전압출력 사용시 1: + 24  2: 1-5V 3: GND
- BNG 유량 측정/제어
- (near CH405) 485 +
- (near CH405) 485 -
- (near CH405) GND
- cnt,1 or 2
- DC 0    4
- OF05ZAT-AR
- (near CH407) 개질수 공급압력
- * 제일 먼 장비에 종단저항 120옴 설치할것
- (near CH407) +24Vee
- (near CH407) 4-20mA
- (near R412) 환기팬1
- (near CH407) * 3선식 전압출력 사용시 1: + 24  2: 1-5V 3: GND
- (near CH408) PNG 유량 측정/제어
- (near CH409) 가스 버퍼탱크 압력 확인용
- (near CW409) 메탄누출감지
- (near CH409) 1-5V
- (near CH409) GND
- (near CH409) +24
- * 4선식 전압출력: 백색은 사용안함.
- (near CW411) 수소누출감지
- (near CH411) 개질기 버너 압력 확인용
- (near CH410) STACK 공기 유량계
- (near CH410) 1 ~ 5 V
- (near CH410) DC(+)
- (near CH410) DC(-)
- (near CH411) +24
- (near CH411) GND
- (near CH411) 1-5V
- 개질기 버너 공기 유량계
- (near CW414) TJ_SIG
- (near CH413) 개질기 촉매부 압력 확인
- (near CH413) +24
- (near CH413) 1-5V
- (near CH412) 1 ~ 5 V
- (near CH412) DC(+)
- (near CH412) DC(-)
- (near CH413) GND
- (near CW417) DI SPARE1
- (near CH414) Prox 공기 유량계
- (near CH414) DC(+)
- DI 탱크 전도도 센서
- (near CH414) 1 ~ 5 V
- (near CH414) DC(-)
- CM230KA-2-2-LS
- 시스템 냉각수 회수 유량 측정
- (near CH416) +25
- (near CH416) GND
- (near CH416) 1-5V
- (near CH417) 아날로그 센서 _ spare1
- (near CH417) 4~20mA
- (near CH417) DC(+)
- (near CH417) DC(-)

### Library data of the parts
B400-B405 = PC357N14J00F: Integrated Circuit; Part No.: PC357N14J00F; Height: 3mm; Price: 81
C400-C418 = CS1608: Part No.: {Part No}; Price: 6
CH400 CH402 = CH_03: 시티가스 공급압력 확인; Price: {Price}
CH401 CH403 = CH_03: Price: {Price}
CH404 = CH_03: 배기가스 출구 압력 측정 / O T2800 1 bar 0.5%; Price: {Price}
CH405 = CH_04: 개질수 유량계 / 사용부품 : OF05ZAT-AR; Price: {Price}
CH406 CH408 = CH_05: AI_PNG MFC / TSCD230-6SW-CH4 30L; Price: {Price}
CH407 = CH_03: 개질수 압력 / O T2800 10 bar 0.5% / O 4~20mA / O T2800 1 bar 0.5%; Price: {Price}
CH409 = CH_03: 가압 버퍼탱크 압력 측정 / 사용부품 : PSS-01A-R1/8 / O T2800 1 bar 0.5%; Price: {Price}
CH410 CH412 = CH_03: 스택 공기 유량계 / O PFMB7501-04-D / O 1 ~ 5 V 입력 / 4~20mA; Price: {Price}
CH411 CH416 = CH_03: 개질기 버너 압력 확인용 / 사용부품 : PSS-01V-R1/8 / O T2800 1 bar 0.5%; Price: {Price}
CH413 = CH_03: 개질기 촉매부 압력 확인 / 사용부품 : PSS-01V-R1/8 / O T2800 1 bar 0.5%; Price: {Price}
CH414 CH417 = CH_03: Prox 공기 유량계 / O PFMB7501-04-D / O 1 ~ 5 V 출력; Price: {Price}
CH415 = CH_04: [DI 탱크 전도도 센서] / O 4~20mA Input; Price: {Price}
CW400 = SMW250-03D: {도시가스 입압} / 사용부품 : T2800 0.1 bar 0.5% / 시티가스 공급압력 확인; Part No.: SMW025-03; Price: 31.2
CW401 CW403 CW412 CW415 = SMW250-03D: Part No.: SMW025-03; Price: 31.2
CW402 CW404 = SMW250-03D: 개질가스(스택입구) 압력 / 사용부품 : T2800 1 bar 0.5%; Part No.: SMW025-03; Price: 31.2
CW405 = SMW250-04D: 485통신; Name: {Name}; Price: 57.5; Part No.: smw250-04d
CW406 CW408 = SMW250-05D: AI_PNG MFC / TSCD230-6SW-CH4 30L; Part No.: smw025-05; Price: 67.2; Name: AI_PNG MFC
CW407 = SMW250-03D: 개질기 촉매부 압력 확인 / O 사용부품 : T2800 1 bar 0.5% / O 4~20mA Input; Part No.: SMW025-03; Price: 31.2
CW409 = SMW250-03D: GD504 / (메탄가스누출감지기): 가스가 샜을 때 경보(0 또는 1)만 던져주는 순수 상태 감시용 디지털 입력단이야. 고속 처리가 필요 없는 일반 GPIO 특성.; Price: 31.2
CW410 = SMW250-03D: 가압 버퍼탱크 압력 측정 / 사용부품 : PSS-01V-R1/8; Part No.: SMW025-03; Price: 31.2
CW411 CW417 = SMW250-03D: GD505 (수소 가스누출감지기): 가스가 샜을 때 경보(0 또는 1)만 던져주는 순수 상태 감시용 디지털 입력단이야. 고속 처리가 필요 없는 일반 GPIO 특성.; Price: 31.2
CW413 CW420 = SMW250-03D: 개질기 버너 압력 확인용 / 사용부품 : PSS-01V-R1/8; Part No.: SMW025-03; Name: AI_PT124; Price: 31.2
CW416 = SMW250-03D: 개질기 촉매부 압력 확인 / 사용부품 : PSS-01V-R1/8; Part No.: SMW025-03; Name: AI_PT124; Price: 31.2
CW418 CW421 = SMW250-03D: Part No.: SMW025-03; Name: {Name}; Price: 31.2
CW419 = SMW250-04D: [DI 탱크 전도도 센서] / O 4~20mA Input[DI 탱크 전도도 센서]; Name: AI_CS324; Price: 57.5; Part No.: smw250-04d
IC400-IC403 = ADS1115BQDGSRQ1: Integrated Circuit; Height: 1.1mm; Part No.: ADS1115BQDGSRQ1; Price: 4490
R400 R403 R406 R408 R414 R417 R420 R427 R428 R435 R436 R443 R444 R452 R453 = R1608: Part No.: WR06X101JT(100R)J; Price: 1.0
R401 R404 R407 R410 R415 R421 R423 R429 R430 R437 R438 R445 R446 R454 R456 = R1608: Part No.: WR06X2490FT(249R)F; Price: 1.0
R402 R405 R409 R413 R416 R422 R424 R431 R432 R439 R441 R447 R450 R455 R457 = R3216: Part No.: WR12X000PT(0R)J; Price: 2.1
R411 R418 R425 R433 R440 R448 = R1608: Part No.: WR06X103JT(10KR)J; Price: 1.0
R412 = R1608: Part No.: WR06X332JT(3.3KR)J; Price: 1.0
R419 R426 R434 R442 R449 R451 = R2012: 규격: {Value}; Price: 2
Tp400-Tp404 Tp406-Tp420 = Tp_5000: Pad30; Part No.: *
Tp405 = Tp_5000: Pad30; NetName: DI_FAN504; Part No.: *
CW414 = SMW250-03D: Price: 31.2
D400-D414 = BAT54C-G: Price: 35

## Sheet Mcu.SchDoc: Mcu
size A3; ApprovedBy: ANBI; CheckedBy: ANBI; CompanyName: DongA FuelCell; DrawnBy: seokipo; Engineer: seokipo; Revision: 001; SheetNumber: 4; SheetTotal: 6
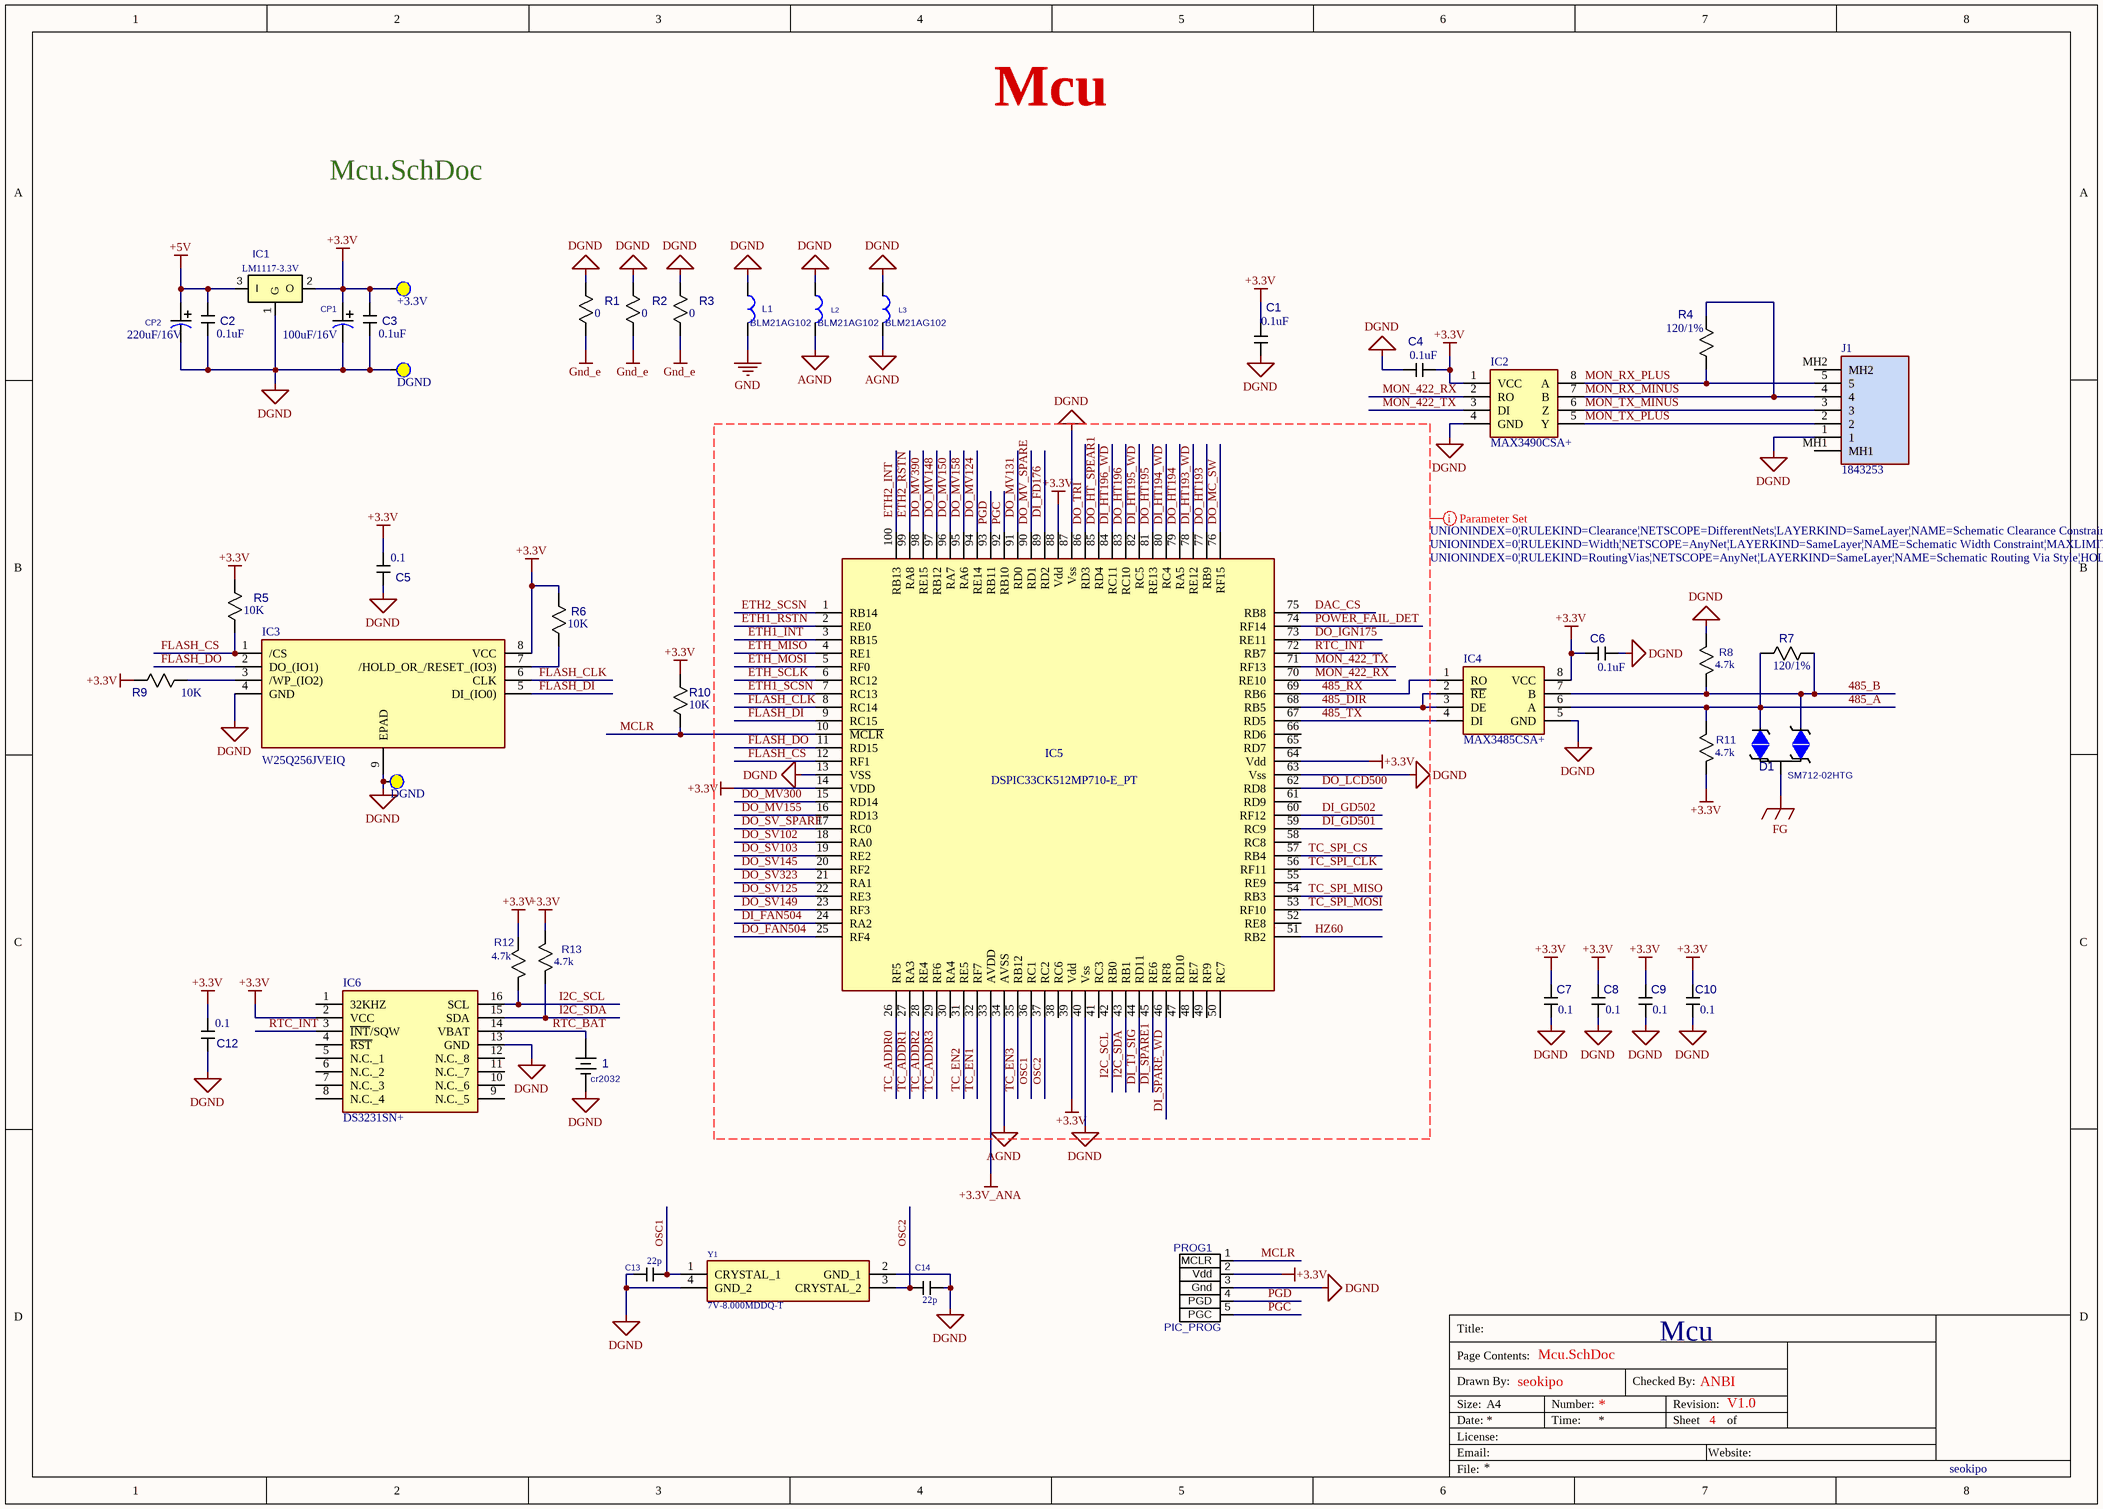
[diagram p11: Mcu.SchDoc]

### Parts
(Parts that share a designator on the sheet are numbered #1, #2 ... from top to bottom, then left to right.)
1  Part No.: cr2032  [BATT_CASE_2032]  (hidden comment: BATT_CR20)
+3.3V  Test Point_top  [TP_KEYSTONE_5000]  (value not drawn)
C1  value 0.1uF  [CC1608N]  (hidden comment: CS1608)
C2  규격: 0.1uF  [CC1608N]  (hidden comment: CS1608)
C3  규격: 0.1uF  [CC1608N]  (hidden comment: CS1608)
C4  value 0.1uF  [CC1608N]  (hidden comment: CS1608)
C5  규격: 0.1  [CC1608N]  (hidden comment: CS1608)
C6  규격: 0.1uF  [CC1608N]  (hidden comment: CS1608)
C7  규격: 0.1  [CC1608N]  (hidden comment: CS1608)
C8  규격: 0.1  [CC1608N]  (hidden comment: CS1608)
C9  규격: 0.1  [CC1608N]  (hidden comment: CS1608)
C10  규격: 0.1  [CC1608N]  (hidden comment: CS1608)
C12  규격: 0.1  [CC1608N]  (hidden comment: CS1608)
C13  규격: 22p  [CC1608N]  (hidden comment: CS1608)
C14  규격: 22p  [CC1608N]  (hidden comment: CS1608)
CP1  규격: 100uF/16V  [CP5_SMT]  (hidden comment: CP5_SMT)
CP2  규격: 220uF/16V  [CP6_SMT]  (hidden comment: CP6_SMT)
D1  Part No.: SM712-02HTG  [SOT95P240X115-3N]  (hidden comment: TVS5025)
DGND#1  Test Point_top  [TP_KEYSTONE_5000]  (value not drawn)
DGND#2  Test Point_top  [TP_KEYSTONE_5000]  (value not drawn)
IC1  Part No.: LM1117-3.3V  [SOT-223]  (hidden comment: 1117SO)
IC2  MAX3490CSA+  [SOIC127P600X175-8N]
IC3  W25Q256JVEIQ  [SON127P800X600X80-9N-D]
IC4  MAX3485CSA+  [SOIC127P600X175-8N]
IC5  DSPIC33CK512MP710-E_PT  [QFP40P1400X1400X120-100N]
IC6  DS3231SN+  [SOIC127P1032X265-16N]
J1  1843253  [1818025]
L1  Part No.: BLM21AG102  [BEADC2012X110N]  (hidden comment: L)
L2  Part No.: BLM21AG102  [BEADC2012X110N]  (hidden comment: L)
L3  Part No.: BLM21AG102  [BEADC2012X110N]  (hidden comment: L)
PROG1  PIC_PROG  [PIC_PROG]
R1  규격: 0  [R3216]  (hidden comment: R3216)
R2  규격: 0  [R3216]  (hidden comment: R3216)
R3  value 0  [R3216]  (hidden comment: R3216)
R4  value 120/1%  [R2012]  (hidden comment: R2012)
R5  규격: 10K  [RESC1608X55N]  (hidden comment: R1608)
R6  규격: 10K  [RESC1608X55N]  (hidden comment: R1608)
R7  규격: 120/1%  [R2012]  (hidden comment: R2012)
R8  규격: 4.7k  [RESC1608X55N]  (hidden comment: R1608)
R9  규격: 10K  [RESC1608X55N]  (hidden comment: R1608)
R10  규격: 10K  [RESC1608X55N]  (hidden comment: R1608)
R11  규격: 4.7k  [RESC1608X55N]  (hidden comment: R1608)
R12  value 4.7k  [RESC1608X55N]  (hidden comment: R1608)
R13  Vlaue: 4.7k  [RESC1608X55N]  (hidden comment: R1608)
Y1  7V-8.000MDDQ-T  [7M25000MEEQT]

### Nets
+3.3V: +3.3V.1(tp) C1.1 C3.2 C4.1 C5.2 C6.1 C7.2 C8.2 C9.2 C10.2 C12.2 CP1.2 IC1.2(O) IC2.1(VCC) IC3.8(VCC) IC4.8(VCC) IC5.14(VDD) IC5.39(Vdd) IC5.64(Vdd) IC5.88(Vdd) IC6.2(VCC) PROG1.2(Vdd) R5.1 R6.1 R9.1 R10.1 R11.2 R12.2 R13.2
+3.3V_ANA: IC5.33(AVDD)
+5V: C2.2 CP2.2 IC1.3(I)
AGND: IC5.34(AVSS) L2.1 L3.1
DGND: 1.2 C1.2 C2.1 C3.1 C4.2 C5.1 C6.2 C7.1 C8.1 C9.1 C10.1 C12.1 C13.2 C14.1 CP1.1 CP2.1 DGND#1.1(tp) DGND#2.1(tp) IC1.1(G) IC2.4(GND) IC3.4(GND) IC3.9(EPAD) IC4.5(GND) IC5.13(VSS) IC5.40(Vss) IC5.63(Vss) IC5.87(Vss) IC6.13(GND) J1.1 L1.2 L2.2 L3.2 PROG1.3(Gnd) R1.2 R2.2 R3.2 R8.2 Y1.2(GND_1) Y1.4(GND_2)
FG: D1.3
GND: L1.1
Gnd_e: R1.1 R2.1 R3.1
485_A: D1.2 IC4.6(A) R7.2 R11.1
485_B: D1.1 IC4.7(B) R7.1 R8.1
485_DIR: IC4.2(~{RE}) IC4.3(DE) IC5.68(RB5)
485_RX: IC4.1(RO) IC5.69(RB6)
485_TX: IC4.4(DI) IC5.67(RD5)
DAC_CS: IC5.75(RB8)
DI_FAN504: IC5.24(RA2)
DI_FD176: IC5.89(RD2)
DI_GD501: IC5.59(RC9)
DI_GD502: IC5.60(RF12)
DI_HT193_WD: IC5.78(RE12)
DI_HT194_WD: IC5.80(RC4)
DI_HT195_WD: IC5.82(RC5)
DI_HT196_WD: IC5.84(RC11)
DI_SPARE1: IC5.45(RE6)
DI_SPARE_WD: IC5.46(RF8)
DI_TJ_SIG: IC5.44(RD11)
DO_FAN504: IC5.25(RF4)
DO_HT193: IC5.77(RB9)
DO_HT194: IC5.79(RA5)
DO_HT195: IC5.81(RE13)
DO_HT196: IC5.83(RC10)
DO_HT_SPEAR1: IC5.85(RD4)
DO_IGN175: IC5.73(RE11)
DO_LCD500: IC5.62(RD8)
DO_MC_SW: IC5.76(RF15)
DO_MV124: IC5.94(RE14)
DO_MV131: IC5.91(RD0)
DO_MV148: IC5.97(RB12)
DO_MV150: IC5.96(RA7)
DO_MV155: IC5.16(RD13)
DO_MV158: IC5.95(RA6)
DO_MV300: IC5.15(RD14)
DO_MV390: IC5.98(RE15)
DO_MV_SPARE: IC5.90(RD1)
DO_SV102: IC5.18(RA0)
DO_SV103: IC5.19(RE2)
DO_SV125: IC5.22(RE3)
DO_SV145: IC5.20(RF2)
DO_SV149: IC5.23(RF3)
DO_SV323: IC5.21(RA1)
DO_SV_SPARE: IC5.17(RC0)
DO_TRI: IC5.86(RD3)
ETH1_INT: IC5.3(RB15)
ETH1_RSTN: IC5.2(RE0)
ETH1_SCSN: IC5.7(RC13)
ETH2_INT: IC5.100(RB13)
ETH2_RSTN: IC5.99(RA8)
ETH2_SCSN: IC5.1(RB14)
ETH_MISO: IC5.4(RE1)
ETH_MOSI: IC5.5(RF0)
ETH_SCLK: IC5.6(RC12)
FLASH_CLK: IC3.6(CLK) IC5.8(RC14)
FLASH_CS: IC3.1(/CS) IC5.12(RF1) R5.2
FLASH_DI: IC3.5(DI_(IO0)) IC5.9(RC15)
FLASH_DO: IC3.2(DO_(IO1)) IC5.11(RD15)
HZ60: IC5.51(RB2)
I2C_SCL: IC5.42(RB0) IC6.16(SCL) R12.1
I2C_SDA: IC5.43(RB1) IC6.15(SDA) R13.1
MCLR: IC5.10(~{MCLR}) PROG1.1(MCLR) R10.2
MON_422_RX: IC2.2(RO) IC5.70(RE10)
MON_422_TX: IC2.3(DI) IC5.71(RF13)
MON_RX_MINUS: IC2.7(B) J1.4 R4.1
MON_RX_PLUS: IC2.8(A) J1.5 R4.2
MON_TX_MINUS: IC2.6(Z) J1.3
MON_TX_PLUS: IC2.5(Y) J1.2
OSC1: C13.1 IC5.36(RC1) Y1.1(CRYSTAL_1)
OSC2: C14.2 IC5.37(RC2) Y1.3(CRYSTAL_2)
PGC: IC5.92(RB10) PROG1.5(PGC)
PGD: IC5.93(RB11) PROG1.4(PGD)
POWER_FAIL_DET: IC5.74(RF14)
RTC_BAT: 1.1 IC6.14(VBAT)
RTC_INT: IC5.72(RB7) IC6.3(~{INT}/SQW)
TC_ADDR0: IC5.26(RF5)
TC_ADDR1: IC5.27(RA3)
TC_ADDR2: IC5.28(RE4)
TC_ADDR3: IC5.29(RF6)
TC_EN1: IC5.32(RF7)
TC_EN2: IC5.31(RE5)
TC_EN3: IC5.35(RB12)
TC_SPI_CLK: IC5.56(RF11)
TC_SPI_CS: IC5.57(RB4)
TC_SPI_MISO: IC5.54(RB3)
TC_SPI_MOSI: IC5.53(RF10)
NetIC3_3: IC3.3(/WP_(IO2)) R9.2
NetIC3_7: IC3.7(/HOLD_OR_/RESET_(IO3)) R6.2

Not connected (* = marked no-connect by the designer): 1 3 4; IC1 4; IC5 30(RA4) 38(RC6) 41(RC3) 47(RD10) 48(RE7) 49(RF9) 50(RC7) 52(RE8) 55(RE9) 58(RC8) 61(RD9) 65(RD7) 66(RD6); IC6 1(32KHZ) 4(~{RST}) 5(N.C._1) 6(N.C._2) 7(N.C._3) 8(N.C._4) 9(N.C._5) 10(N.C._6) 11(N.C._7) 12(N.C._8); J1 MH1 MH2

### Layout directives
rule Clearance Constraint [Clearance = 0.15mm]; rule Width Constraint [Pref Width = 0.3mm    Min Width = 0.2mm    Max Width = 0.5mm]; rule Routing Via Style [Pref Size = 0.3mm    Pref Hole Size = 0.5mm]: 485_DIR, 485_RX, 485_TX, +3.3V, AGND, DAC_CS, DGND, DI_FAN504, DI_FD176, DI_GD501, DI_GD502, DI_HT193_WD, DI_HT194_WD, DI_HT195_WD, DI_HT196_WD, DI_SPARE1, DI_SPARE_WD, DI_TJ_SIG, DO_FAN504, DO_HT193, DO_HT194, DO_HT195, DO_HT196, DO_HT_SPEAR1, DO_IGN175, DO_LCD500, DO_MC_SW, DO_MV124, DO_MV131, DO_MV148, DO_MV150, DO_MV155, DO_MV158, DO_MV300, DO_MV390, DO_MV_SPARE, DO_SV102, DO_SV103, DO_SV125, DO_SV145, DO_SV149, DO_SV323, DO_SV_SPARE, DO_TRI, ETH1_INT, ETH1_RSTN, ETH1_SCSN, ETH2_INT, ETH2_RSTN, ETH2_SCSN, ETH_MISO, ETH_MOSI, ETH_SCLK, FLASH_CLK, FLASH_CS, FLASH_DI, FLASH_DO, HZ60, I2C_SCL, I2C_SDA, MON_422_RX, MON_422_TX, OSC1, OSC2, PGC, PGD, POWER_FAIL_DET, RTC_INT, TC_ADDR0, TC_ADDR1, TC_ADDR2, TC_ADDR3, TC_EN1, TC_EN2, TC_EN3, TC_SPI_CLK, TC_SPI_CS, TC_SPI_MISO, TC_SPI_MOSI

### Notes on the sheet
- Mcu.SchDoc
- Labels drawn without touching a wire or pin: +3.3V
- Title:
- Drawn By:
- Page Contents:
- Checked By:
- Size:
- Date:
- File:
- License:
- Email:
- A4
- Number:
- Time:
- Revision:
- Sheet
- Website:
- of

### Library data of the parts
+3.3V DGND#1 DGND#2 = Tp_5000: Pad30; Part No.: *
C1-C10 C12-C14 = CS1608: Part No.: {Part No}; Price: 6
CP1 = CP5_SMT: Part No.: {Part No}; Price: 31
CP2 = CP6_SMT: Part No.: RV16V220 6.3X7.7 (ELNA / 삼영); ComponentLink1Description: New link; ComponentLink1URL: *; Price: 40
D1 = TVS_23: Price: 370
IC1 = 1117SO: Value: {Value}; Price: {Price}
IC2 = MAX3490CSA+: Integrated Circuit; Height: 1.75mm; Part No.: MAX3490CSA+; Price: 9200
IC3 = W25Q256FVEIQ: Integrated Circuit; Height: 0.8mm; Price: 9700; Part No.: W25Q256JVEIQ
IC4 = MAX3485CSA+: Integrated Circuit; Height: 1.75mm; Part No.: MAX3485CSA+; Price: 8140
IC5 = DSPIC33CK512MP710-E_PT: Integrated Circuit; Manufacturer_Name: Microchip; Height: 1.2mm; Price: 6800; Part No.: DSPIC33CK512MP710-E_PT
IC6 = DS3231SN+: Integrated Circuit; Height: 2.65mm; Part No.: DS3231SN+; Price: 8400
J1 = 1818025: MCV 1,5/ 5-GF-3,5-LR - PCB headers, nominal cross section: 1.5 mm<sup>2</sup>, color: green, nominal current: 8 A, rated voltage (III/2): 160 V, contact surface: Sn, contact connection type: Pin, number of potentials: 5, number of rows: 1, number of positions: 5, number of connections: 5, product range: MCV 1,5/..-GF-LR, pitch: 3.5 mm, mounting: Wave soldering, pin layout: Linear pinning, solder pin [P]: 3.4 mm, number of solder pins per potential: 1, plug-in system: COMBICON MC 1,5, Pin connector pattern a; Manufacturer_Name: Phoenix Contact; Geometry.Height: 9.35mm; Part No.: 1843253; Price: 8230
L1-L3 = BEAD2012
R1-R3 = R3216: Part No.: {Part No}; Price: {Price}
R4 = R2012: Part No.: WR06X1200FT(120R)F; Price: 2
R5 R6 R9 R10 R12 R13 = R1608: Part No.: {Part No}; Price: {Price}
R7 = R2012: Part No.: {Part No}; Price: 2
R8 R11 = R1608: Part No.: WR06X472JT(4.7KR)J; Price: 1
Y1 = 7M-25.000MEEQ-T: Crystal or Oscillator; Height: 0.8mm; Price: 1100; Part No.: 7V-8.000MDDQ-T
PROG1 = PIC_PROG: Part No.: *; Price: {Price}

## Sheet Ethernet.SchDoc: Ethernet
size A4; SheetNumber: 5; SheetTotal: 6
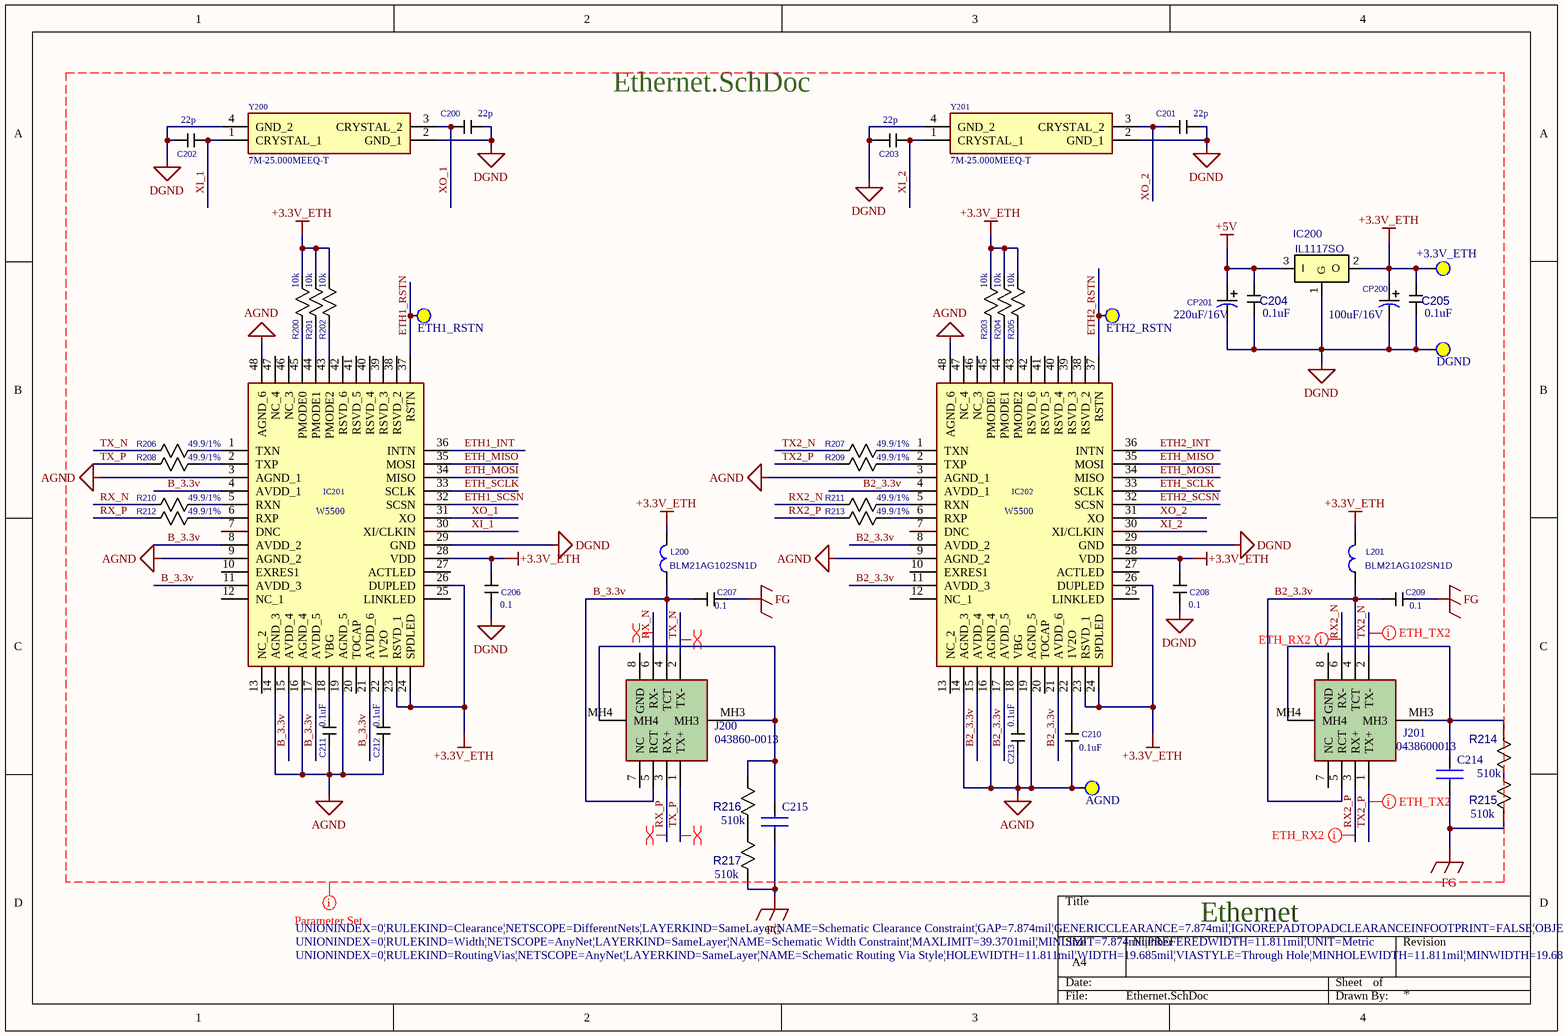
[diagram p12: Ethernet.SchDoc]

### Parts
(Parts that share a designator on the sheet are numbered #1, #2 ... from top to bottom, then left to right.)
+3.3V_ETH  Test Point_top  [TP_KEYSTONE_5000]  (value not drawn)
AGND#2  Test Point_top  [TP_KEYSTONE_5000]  (value not drawn)
C200  규격: 22p  [CC1608N]  (hidden comment: CS1608)
C201  규격: 22p  [CC1608N]  (hidden comment: CS1608)
C202  규격: 22p  [CC1608N]  (hidden comment: CS1608)
C203  규격: 22p  [CC1608N]  (hidden comment: CS1608)
C204  규격: 0.1uF  [CC1608N]  (hidden comment: CS1608)
C205  규격: 0.1uF  [CC1608N]  (hidden comment: CS1608)
C206  규격: 0.1  [CC1608N]  (hidden comment: CS1608)
C207  규격: 0.1  [CC1608N]  (hidden comment: CS1608)
C208  규격: 0.1  [CC1608N]  (hidden comment: CS1608)
C209  규격: 0.1  [CC1608N]  (hidden comment: CS1608)
C210  규격: 0.1uF  [CC1608N]  (hidden comment: CS1608)
C211  규격: 0.1uF  [CC1608N]  (hidden comment: CS1608)
C212  규격: 0.1uF  [CC1608N]  (hidden comment: CS1608)
C213  규격: 0.1uF  [CC1608N]  (hidden comment: CS1608)
C214  C4520X7R3D102K130KA  [C4520_Commercial]  (value not drawn)
C215  C4520X7R3D102K130KA  [C4520_Commercial]  (value not drawn)
CP200  규격: 100uF/16V  [CP5_SMT]  (hidden comment: CP5_SMT)
CP201  규격: 220uF/16V  [CP6_SMT]  (hidden comment: CP6_SMT)
DGND#3  Test Point_top  [TP_KEYSTONE_5000]  (value not drawn)
ETH1_RSTN  Test Point_top  [TP_KEYSTONE_5000]  (value not drawn)
ETH2_RSTN  Test Point_top  [TP_KEYSTONE_5000]  (value not drawn)
IC200  IL1117SO  [SOT-223]
IC201  W5500  [QFP50P900X900X160-48N]
IC202  W5500  [QFP50P900X900X160-48N]
J200  043860-0013  [0438600013]
J201  0438600013  [0438600013]
L200  BLM21AG102SN1D  [RESC1608X55N]
L201  BLM21AG102SN1D  [RESC1608X55N]
R200  규격: 10k  [RESC1608X55N]  (hidden comment: R1608)
R201  규격: 10k  [RESC1608X55N]  (hidden comment: R1608)
R202  규격: 10k  [RESC1608X55N]  (hidden comment: R1608)
R203  규격: 10k  [RESC1608X55N]  (hidden comment: R1608)
R204  규격: 10k  [RESC1608X55N]  (hidden comment: R1608)
R205  규격: 10k  [RESC1608X55N]  (hidden comment: R1608)
R206  규격: 49.9/1%  [RESC1608X55N]  (hidden comment: R1608)
R207  규격: 49.9/1%  [RESC1608X55N]  (hidden comment: R1608)
R208  규격: 49.9/1%  [RESC1608X55N]  (hidden comment: R1608)
R209  규격: 49.9/1%  [RESC1608X55N]  (hidden comment: R1608)
R210  규격: 49.9/1%  [RESC1608X55N]  (hidden comment: R1608)
R211  규격: 49.9/1%  [RESC1608X55N]  (hidden comment: R1608)
R212  규격: 49.9/1%  [RESC1608X55N]  (hidden comment: R1608)
R213  규격: 49.9/1%  [RESC1608X55N]  (hidden comment: R1608)
R214  규격: 510k  [R3216]  (hidden comment: R3216)
R215  규격: 510k  [R3216]  (hidden comment: R3216)
R216  규격: 510k  [R3216]  (hidden comment: R3216)
R217  규격: 510k  [R3216]  (hidden comment: R3216)
Y200  7M-25.000MEEQ-T  [7M25000MEEQT]
Y201  7M-25.000MEEQ-T  [7M25000MEEQT]

### Nets
+3.3V_ETH: +3.3V_ETH.1(tp) C205.2 C206.2 C208.2 CP200.2 IC200.2(O) IC201.23(RSVD_1) IC201.24(SPDLED) IC201.26(DUPLED) IC201.28(VDD) IC202.23(RSVD_1) IC202.24(SPDLED) IC202.26(DUPLED) IC202.28(VDD) L200.1 L201.1 R200.1 R201.1 R202.1 R203.1 R204.1 R205.1
+5V: C204.2 CP201.2 IC200.3(I)
AGND: AGND#2.1(tp) C210.2 C211.2 C212.2 C213.2 IC201.3(AGND_1) IC201.9(AGND_2) IC201.14(AGND_3) IC201.16(AGND_4) IC201.19(AGND_5) IC201.48(AGND_6) IC202.3(AGND_1) IC202.9(AGND_2) IC202.14(AGND_3) IC202.16(AGND_4) IC202.19(AGND_5) IC202.48(AGND_6)
DGND: C200.1 C201.1 C202.2 C203.2 C204.1 C205.1 C206.1 C208.1 CP200.1 CP201.1 DGND#3.1(tp) IC200.1(G) IC201.29(GND) IC202.29(GND) Y200.2(GND_1) Y200.4(GND_2) Y201.2(GND_1) Y201.4(GND_2)
FG: C207.1 C209.1 C214.2 C215.2 R215.1 R217.1
B2_3.3v: C209.2 IC202.4(AVDD_1) IC202.8(AVDD_2) IC202.11(AVDD_3) IC202.15(AVDD_4) IC202.17(AVDD_5) IC202.21(AVDD_6) J201.4(TCT) J201.5(RCT) L201.2
B_3.3v: C207.2 IC201.4(AVDD_1) IC201.8(AVDD_2) IC201.11(AVDD_3) IC201.15(AVDD_4) IC201.17(AVDD_5) IC201.21(AVDD_6) J200.4(TCT) J200.5(RCT) L200.2
ETH1_INT: IC201.36(INTN)
ETH1_RSTN: ETH1_RSTN.1(tp) IC201.37(RSTN)
ETH1_SCSN: IC201.32(SCSN)
ETH2_INT: IC202.36(INTN)
ETH2_RSTN: ETH2_RSTN.1(tp) IC202.37(RSTN)
ETH2_SCSN: IC202.32(SCSN)
ETH_MISO: IC201.35(MOSI) IC202.35(MOSI)
ETH_MOSI: IC201.34(MISO) IC202.34(MISO)
ETH_SCLK: IC201.33(SCLK) IC202.33(SCLK)
RX2_N: J201.6(RX-) R211.1
RX2_P: J201.3(RX+) R213.1
RX_N: J200.6(RX-) R210.1
RX_P: J200.3(RX+) R212.1
TX2_N: J201.2(TX-) R207.1
TX2_P: J201.1(TX+) R209.1
TX_N: J200.2(TX-) R206.1
TX_P: J200.1(TX+) R208.1
XI_1: C202.1 IC201.30(XI/CLKIN) Y200.1(CRYSTAL_1)
XI_2: C203.1 IC202.30(XI/CLKIN) Y201.1(CRYSTAL_1)
XO_1: C200.2 IC201.31(XO) Y200.3(CRYSTAL_2)
XO_2: C201.2 IC202.31(XO) Y201.3(CRYSTAL_2)
NetC210_1: C210.1 IC202.22(1V2O)
NetC211_1: C211.1 IC201.18(VBG)
NetC212_1: C212.1 IC201.22(1V2O)
NetC213_1: C213.1 IC202.18(VBG)
NetC214_1: C214.1 J201.MH3 J201.MH4 R214.2
NetC215_1: C215.1 J200.MH3 J200.MH4 R216.2
NetIC201_1: IC201.1(TXN) R206.2
NetIC201_2: IC201.2(TXP) R208.2
NetIC201_5: IC201.5(RXN) R210.2
NetIC201_6: IC201.6(RXP) R212.2
NetIC201_43: IC201.43(PMODE2) R202.2
NetIC201_44: IC201.44(PMODE1) R201.2
NetIC201_45: IC201.45(PMODE0) R200.2
NetIC202_1: IC202.1(TXN) R207.2
NetIC202_2: IC202.2(TXP) R209.2
NetIC202_5: IC202.5(RXN) R211.2
NetIC202_6: IC202.6(RXP) R213.2
NetIC202_43: IC202.43(PMODE2) R205.2
NetIC202_44: IC202.44(PMODE1) R204.2
NetIC202_45: IC202.45(PMODE0) R203.2
NetR214_1: R214.1 R215.2
NetR216_1: R216.1 R217.2

Not connected (* = marked no-connect by the designer): IC200 4; IC201 7(DNC) 10(EXRES1) 12(NC_1) 13(NC_2) 20(TOCAP) 25(LINKLED) 27(ACTLED) 38(RSVD_2) 39(RSVD_3) 40(RSVD_4) 41(RSVD_5) 42(RSVD_6) 46(NC_3) 47(NC_4); IC202 7(DNC) 10(EXRES1) 12(NC_1) 13(NC_2) 20(TOCAP) 25(LINKLED) 27(ACTLED) 38(RSVD_2) 39(RSVD_3) 40(RSVD_4) 41(RSVD_5) 42(RSVD_6) 46(NC_3) 47(NC_4); J200 7(NC) 8(GND); J201 7(NC) 8(GND)

### Layout directives
rule Clearance Constraint [Clearance = 0.2mm]; rule Width Constraint [Pref Width = 0.3mm    Min Width = 0.2mm    Max Width = 1mm]; rule Routing Via Style [Pref Size = 0.5mm    Pref Hole Size = 0.3mm]: +3.3V_ETH, +5V, AGND, B2_3.3v, B_3.3v, DGND, ETH1_INT, ETH1_RSTN, ETH1_SCSN, ETH2_INT, ETH2_RSTN, ETH2_SCSN, ETH_MISO, ETH_MOSI, ETH_SCLK, FG, RX2_N, RX2_P, RX_N, RX_P, TX2_N, TX2_P, TX_N, TX_P, XI_1, XI_2, XO_1, XO_2
differential pair: RX2_N, RX2_P, RX_N, RX_P, TX2_N, TX2_P, TX_N, TX_P

### Notes on the sheet
- Ethernet.SchDoc

### Library data of the parts
+3.3V_ETH AGND#2 DGND#3 ETH1_RSTN ETH2_RSTN = Tp_5000: Pad30; Part No.: *
C200-C203 = CS1608: Part No.: 0603N220J500; Price: 6
C204-C213 = CS1608: Part No.: {Part No}; Price: 6
C214 C215 = C4520X7R3D102K130KA: Capacitor; Manufacturer_Name: TDK; Datasheet Link: https://product.tdk.com/system/files/dam/doc/product/capacitor/ceramic/mlcc/catalog/mlcc_commercial_highvoltage_en.pdf; Height: 1mm; Part No.: C4520X7R3D102K130KA; Mouser Part Number: 810-C4520X7R3D102K; Mouser Price/Stock: https://www.mouser.co.uk/ProductDetail/TDK/C4520X7R3D102K130KA?qs=NRhsANhppD%2FmDDEB06mgKg%3D%3D; Arrow Part Number: C4520X7R3D102K130KA; Arrow Price/Stock: https://www.arrow.com/en/products/c4520x7r3d102k130ka/tdk?utm_currency=USD&region=nac
CP200 = CP5_SMT: Part No.: {Part No}; Price: 31
CP201 = CP6_SMT: Part No.: RV16V220 6.3X7.7 (ELNA / 삼영); ComponentLink1Description: New link; ComponentLink1URL: *; Price: 40
IC200 = 1117SO: Part No.: IL1117-3.3V; Value: 3.3V/1A; Price: 150
IC201 IC202 = W5500: Integrated Circuit; Manufacturer_Name: Wiznet Technology; Height: 1.6mm; Part No.: W5500; Price: 2480
J200 J201 = 0438600013: Connector; Height: 13.78mm; Part No.: 0438600013; Price: 5380
L200 L201 = BEAD2012: Part No.: BLM21AG102SN1D; Price: 92
R200-R205 = R1608: Part No.: WR06X103JT(10KR)J; Price: 1.0
R206-R213 = R1608: Part No.: {Part No}; Price: 2.5
R214-R217 = R3216: Part No.: WR12X514JT(510KR)J; Price: 2.1
Y200 = 7M-25.000MEEQ-T: Crystal or Oscillator; Manufacturer_Name: TXC CORPORATION; Datasheet Link: https://www.txccrystal.com/images/pdf/7m-accuracy.pdf; Height: 0.8mm; Manufacturer_Part_Number: 7M-25.000MEEQ-T; Mouser Part Number: 717-7M-25.000MEEQ-T; Price: 1540; Part No.: 7M-25.000MEEQ-T; Arrow Price/Stock: https://www.arrow.com/en/products/7m-25.000meeq-t/txc-corporation?region=nac
Y201 = 7M-25.000MEEQ-T: Crystal or Oscillator; Height: 0.8mm; Price: 1540; Part No.: 7M-25.000MEEQ-T